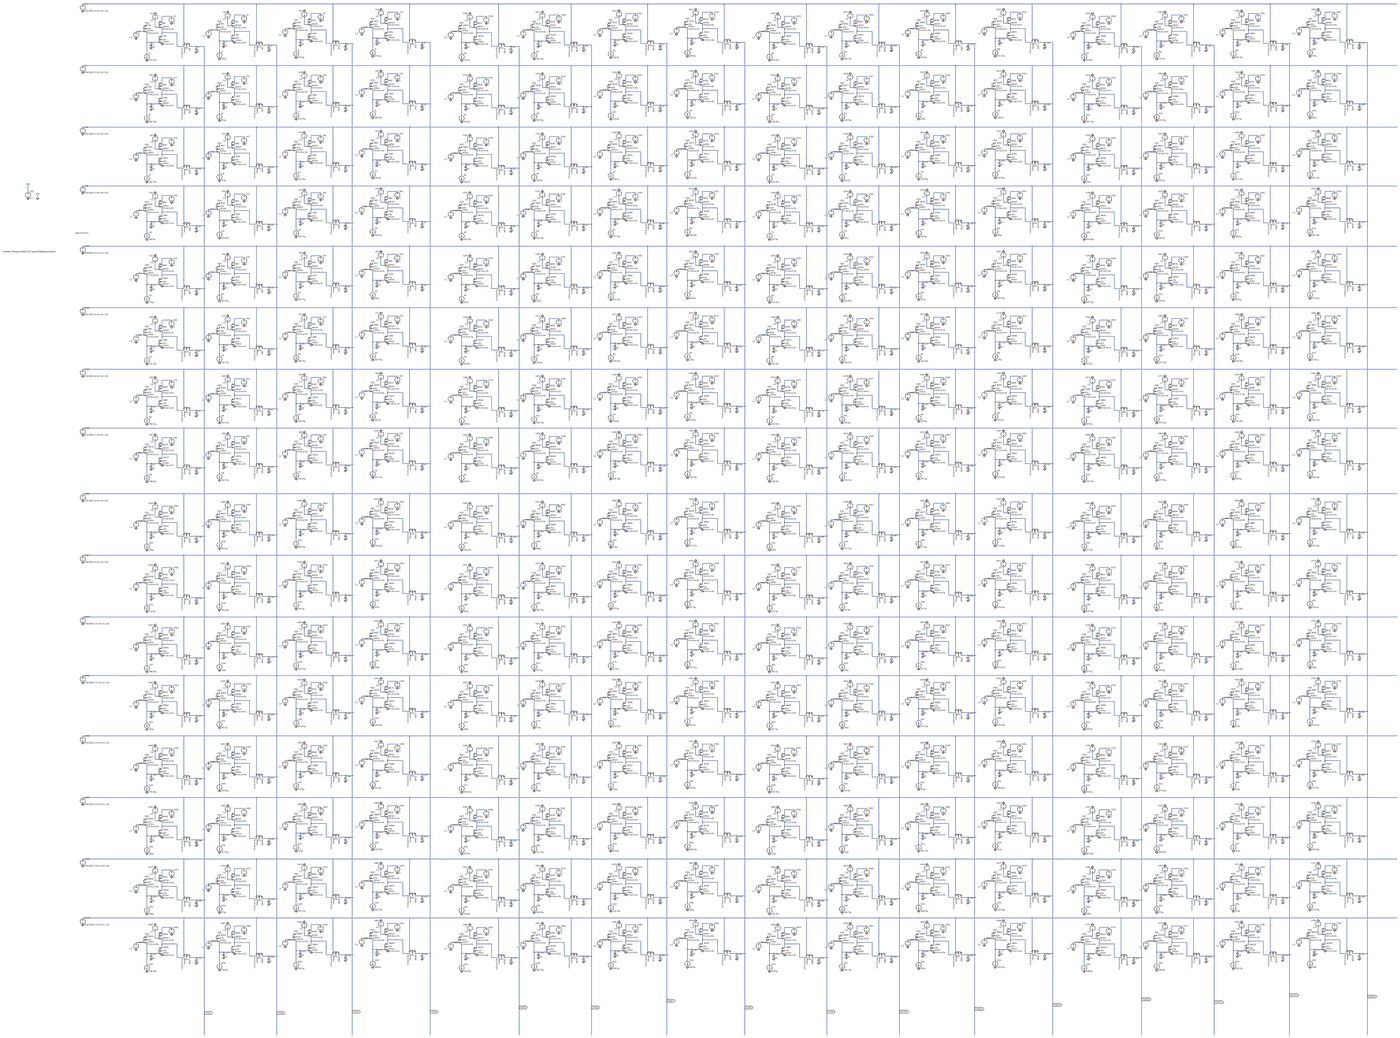
[diagram p0: schematic APS 16_16.asc, whole sheet]
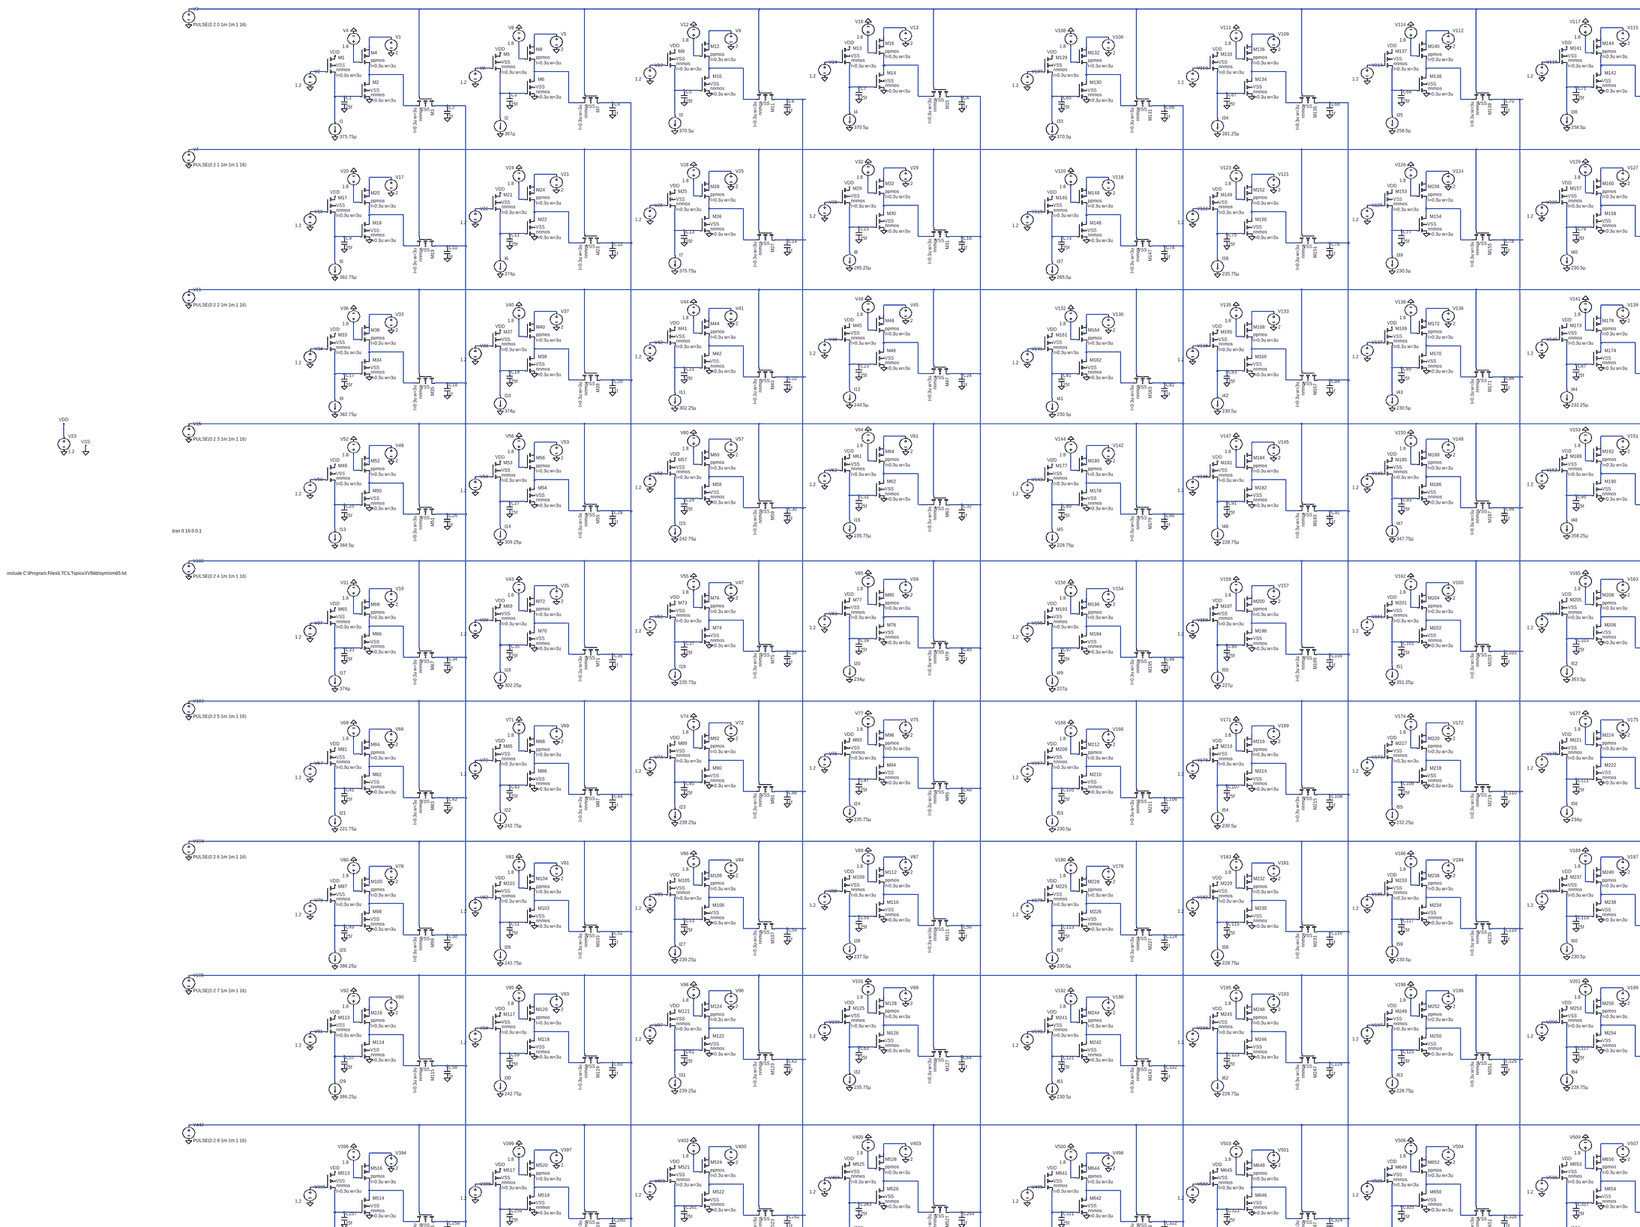
[diagram p1: schematic APS 16_16.asc, part, row 1 of 2, column 1 of 2]
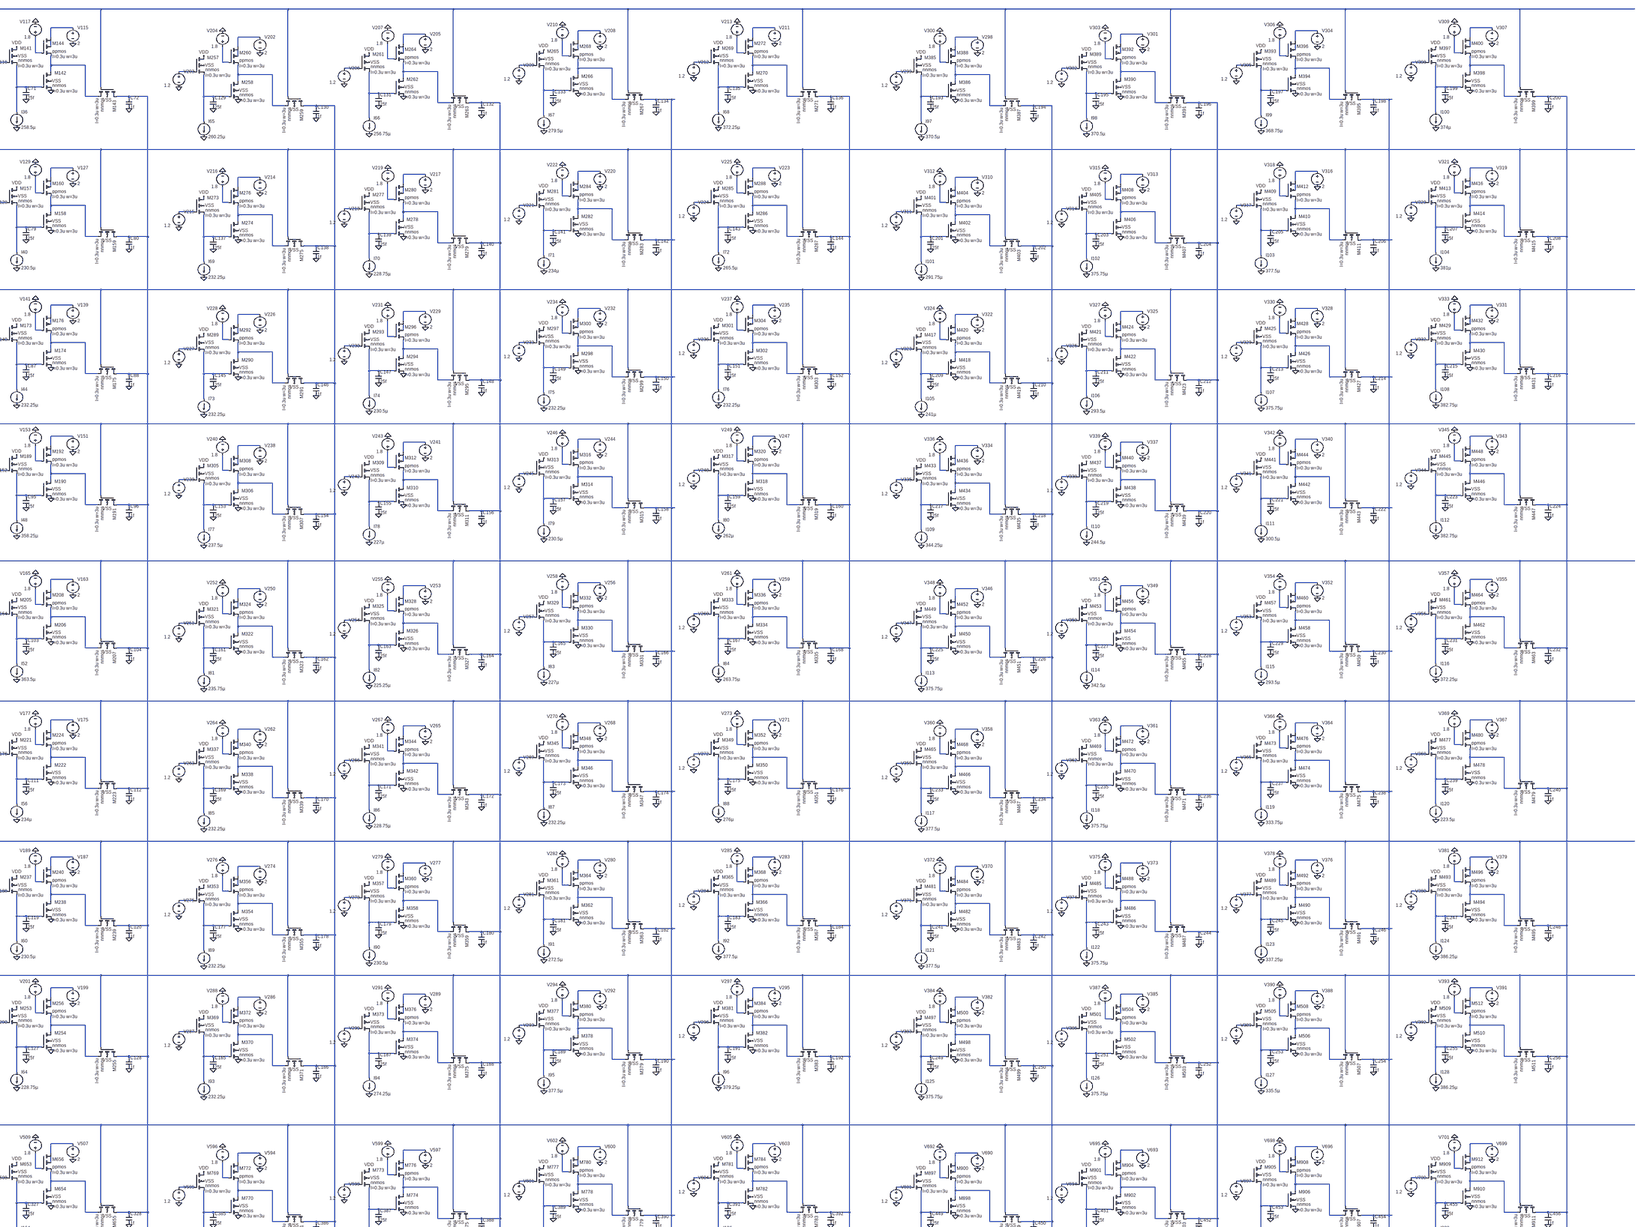
[diagram p2: schematic APS 16_16.asc, part, row 1 of 2, column 2 of 2]
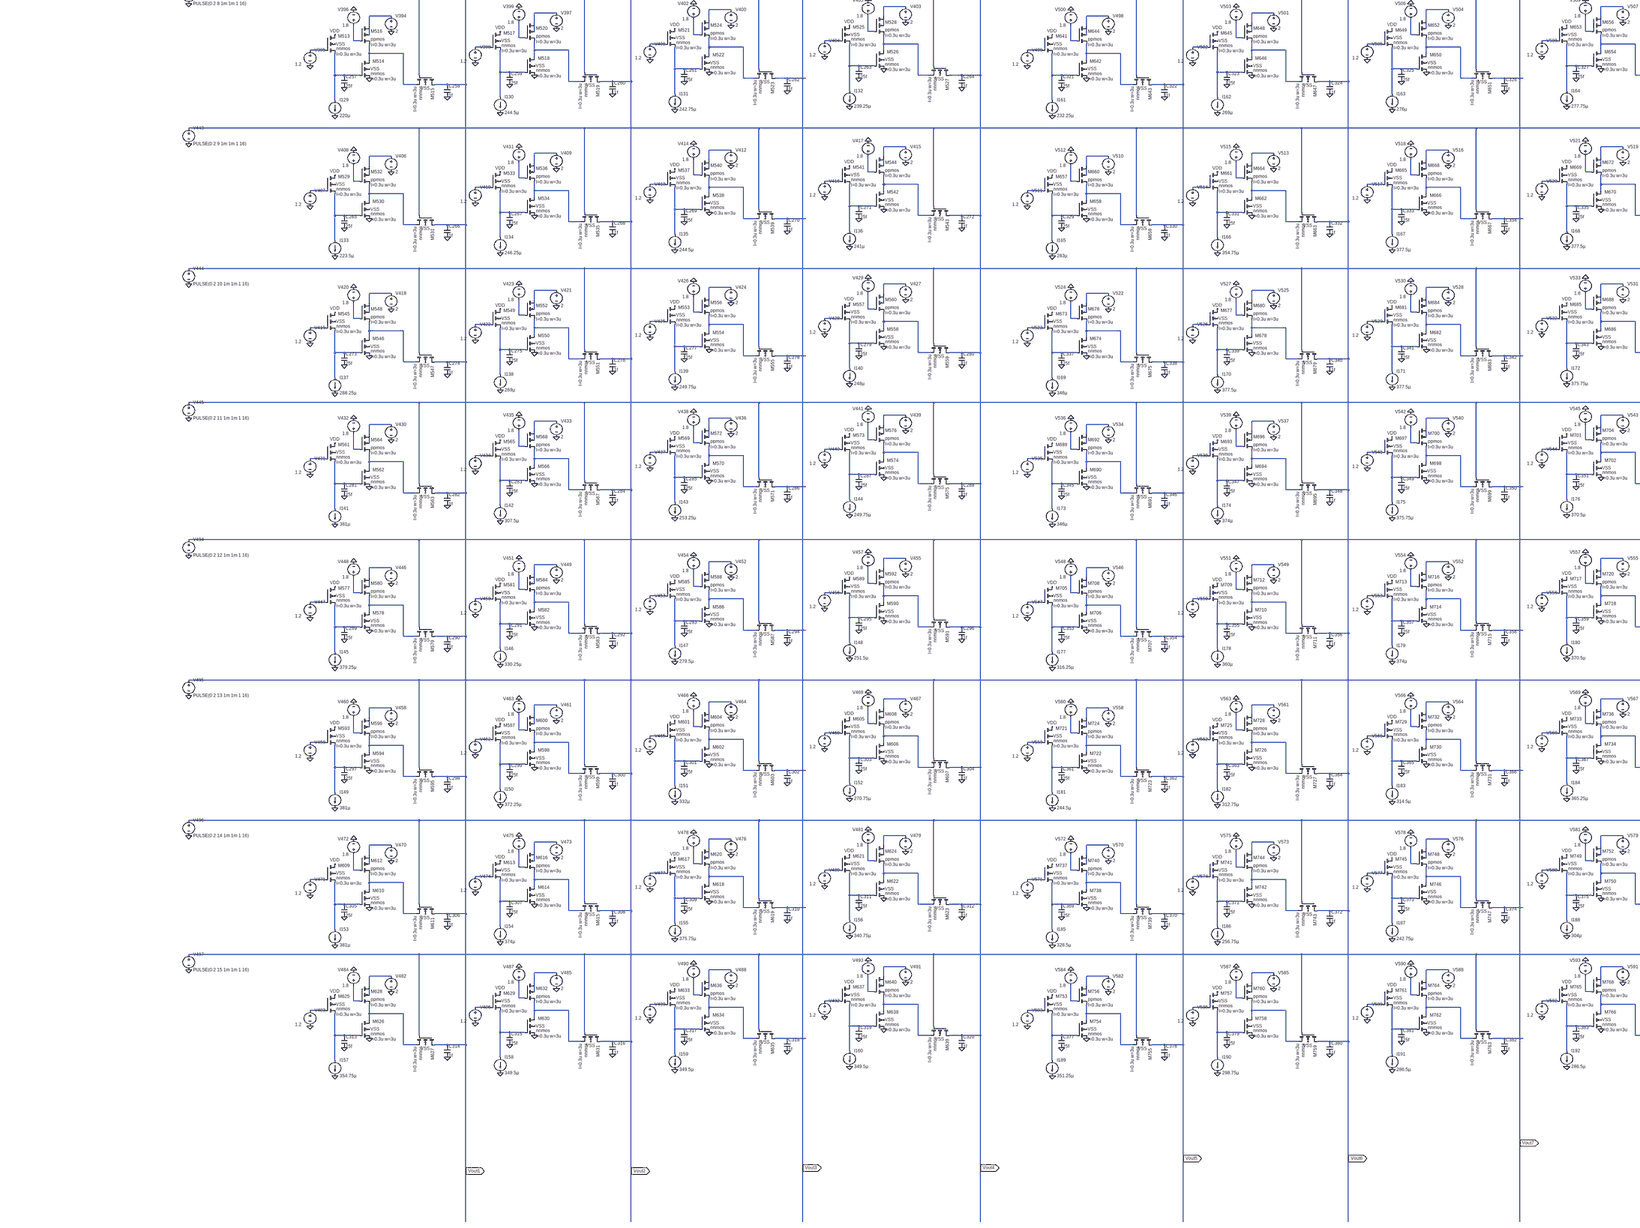
[diagram p3: schematic APS 16_16.asc, part, row 2 of 2, column 1 of 2]
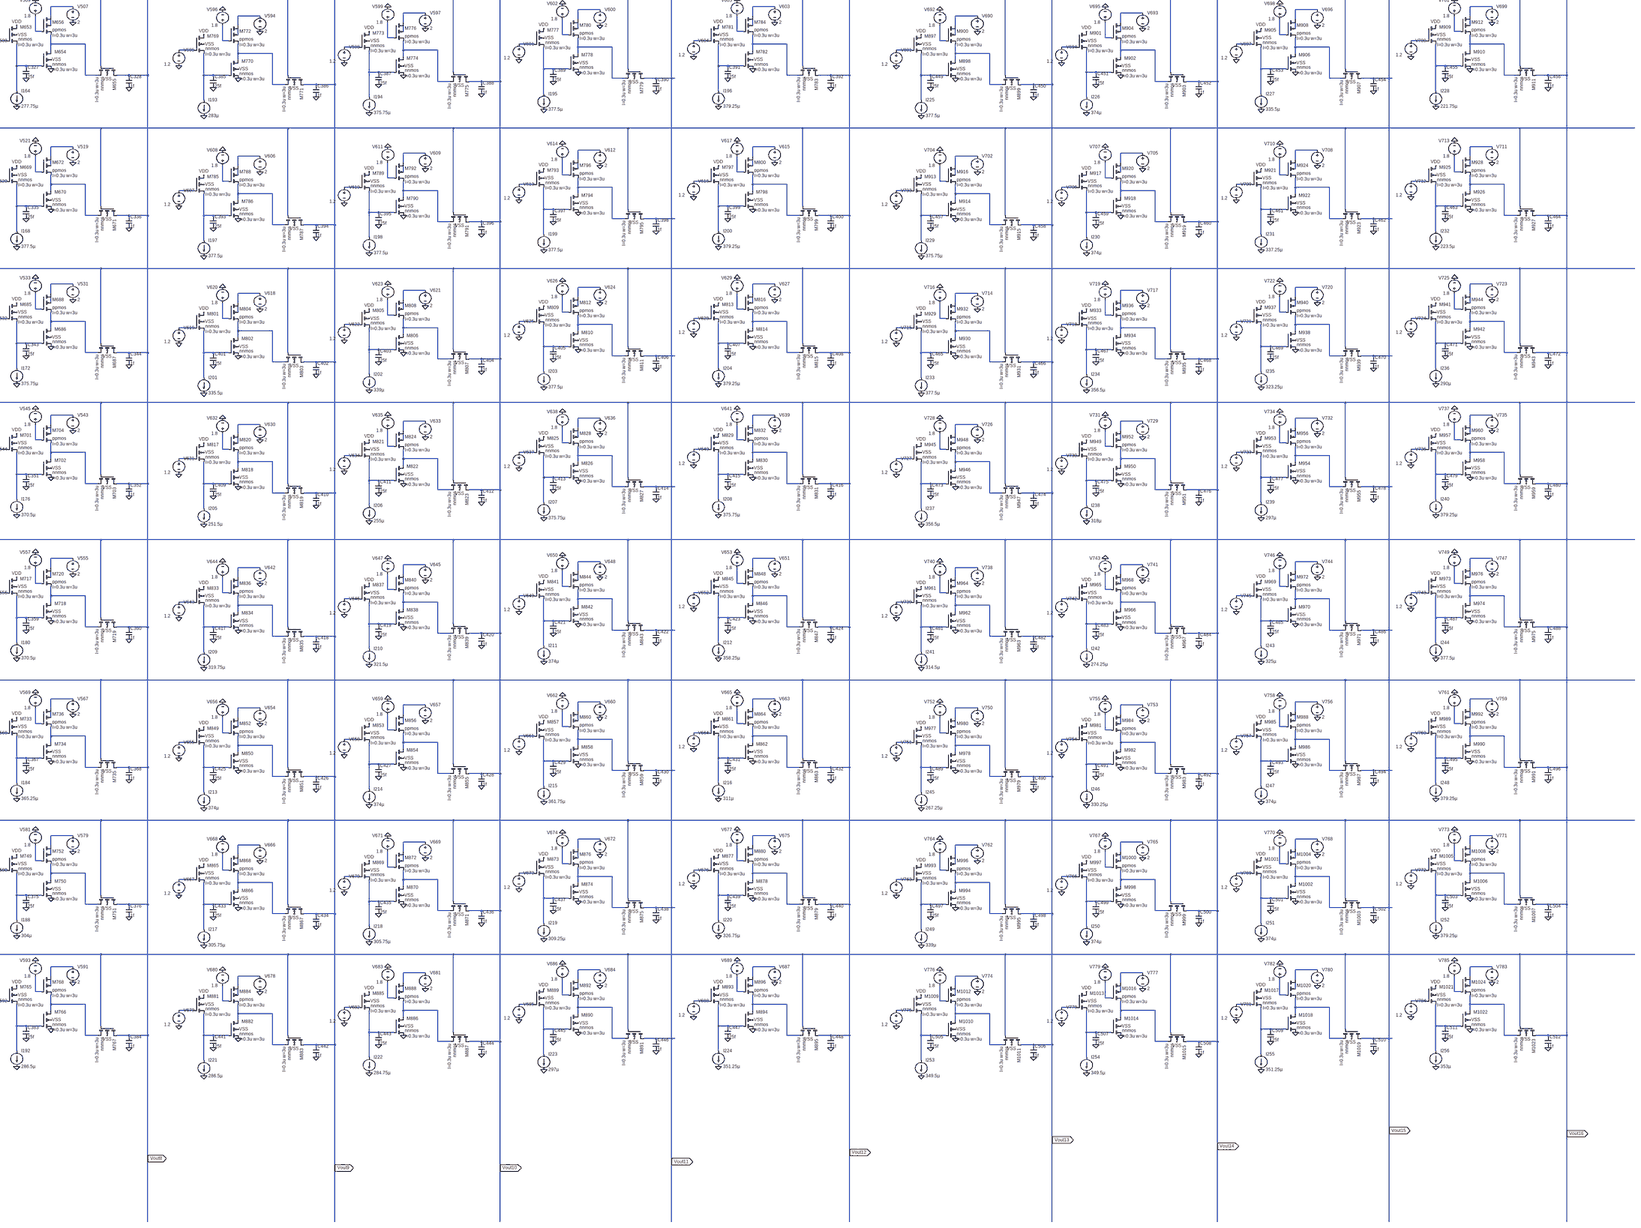
[diagram p4: schematic APS 16_16.asc, part, row 2 of 2, column 2 of 2]
* APS 16_16.asc
M1 VDD N070 N094 0 nnmos l=0.3u w=3u
M2 N078 N094 0 0 nnmos l=0.3u w=3u
M3 Vout1 N001 N078 0 nnmos l=0.3u w=3u
M4 N014 N046 N078 N034 ppmos l=0.3u w=3u
C1 N094 0 25f
C2 Vout1 0 1f
V1 N014 0 2
V2 N070 0 1.2
V4 N046 0 1.8
I1 N094 0 375.75µ
M5 VDD N062 N090 0 nnmos l=0.3u w=3u
M6 N071 N090 0 0 nnmos l=0.3u w=3u
M7 Vout2 N001 N071 0 nnmos l=0.3u w=3u
M8 N010 N042 N071 N026 ppmos l=0.3u w=3u
C3 N090 0 25f
C4 Vout2 0 1f
V5 N010 0 2
V6 N062 0 1.2
V8 N042 0 1.8
I2 N090 0 367µ
M9 VDD N054 N086 0 nnmos l=0.3u w=3u
M10 N063 N086 0 0 nnmos l=0.3u w=3u
M11 Vout3 N001 N063 0 nnmos l=0.3u w=3u
M12 N006 N035 N063 N022 ppmos l=0.3u w=3u
C5 N086 0 25f
C6 Vout3 0 1f
V9 N006 0 2
V10 N054 0 1.2
V12 N035 0 1.8
I3 N086 0 370.5µ
M13 VDD N047 N082 0 nnmos l=0.3u w=3u
M14 N055 N082 0 0 nnmos l=0.3u w=3u
M15 Vout4 N001 N055 0 nnmos l=0.3u w=3u
M16 N002 N027 N055 N018 ppmos l=0.3u w=3u
C7 N082 0 25f
C8 Vout4 0 1f
V13 N002 0 2
V14 N047 0 1.2
V16 N027 0 1.8
I4 N082 0 370.5µ
M17 VDD N167 N191 0 nnmos l=0.3u w=3u
M18 N175 N191 0 0 nnmos l=0.3u w=3u
M19 Vout1 N098 N175 0 nnmos l=0.3u w=3u
M20 N111 N143 N175 N131 ppmos l=0.3u w=3u
C9 N191 0 25f
C10 Vout1 0 1f
V17 N111 0 2
V18 N167 0 1.2
V20 N143 0 1.8
I5 N191 0 382.75µ
M21 VDD N159 N187 0 nnmos l=0.3u w=3u
M22 N168 N187 0 0 nnmos l=0.3u w=3u
M23 Vout2 N098 N168 0 nnmos l=0.3u w=3u
M24 N107 N139 N168 N123 ppmos l=0.3u w=3u
C11 N187 0 25f
C12 Vout2 0 1f
V21 N107 0 2
V22 N159 0 1.2
V24 N139 0 1.8
I6 N187 0 374µ
M25 VDD N151 N183 0 nnmos l=0.3u w=3u
M26 N160 N183 0 0 nnmos l=0.3u w=3u
M27 Vout3 N098 N160 0 nnmos l=0.3u w=3u
M28 N103 N132 N160 N119 ppmos l=0.3u w=3u
C13 N183 0 25f
C14 Vout3 0 1f
V25 N103 0 2
V26 N151 0 1.2
V28 N132 0 1.8
I7 N183 0 375.75µ
M29 VDD N144 N179 0 nnmos l=0.3u w=3u
M30 N152 N179 0 0 nnmos l=0.3u w=3u
M31 Vout4 N098 N152 0 nnmos l=0.3u w=3u
M32 N099 N124 N152 N115 ppmos l=0.3u w=3u
C15 N179 0 25f
C16 Vout4 0 1f
V29 N099 0 2
V30 N144 0 1.2
V32 N124 0 1.8
I8 N179 0 295.25µ
M33 VDD N264 N288 0 nnmos l=0.3u w=3u
M34 N272 N288 0 0 nnmos l=0.3u w=3u
M35 Vout1 N195 N272 0 nnmos l=0.3u w=3u
M36 N208 N240 N272 N228 ppmos l=0.3u w=3u
C17 N288 0 25f
C18 Vout1 0 1f
V33 N208 0 2
V34 N264 0 1.2
V36 N240 0 1.8
I9 N288 0 382.75µ
M37 VDD N256 N284 0 nnmos l=0.3u w=3u
M38 N265 N284 0 0 nnmos l=0.3u w=3u
M39 Vout2 N195 N265 0 nnmos l=0.3u w=3u
M40 N204 N236 N265 N220 ppmos l=0.3u w=3u
C19 N284 0 25f
C20 Vout2 0 1f
V37 N204 0 2
V38 N256 0 1.2
V40 N236 0 1.8
I10 N284 0 374µ
M41 VDD N248 N280 0 nnmos l=0.3u w=3u
M42 N257 N280 0 0 nnmos l=0.3u w=3u
M43 Vout3 N195 N257 0 nnmos l=0.3u w=3u
M44 N200 N229 N257 N216 ppmos l=0.3u w=3u
C21 N280 0 25f
C22 Vout3 0 1f
V41 N200 0 2
V42 N248 0 1.2
V44 N229 0 1.8
I11 N280 0 302.25µ
M45 VDD N241 N276 0 nnmos l=0.3u w=3u
M46 N249 N276 0 0 nnmos l=0.3u w=3u
M47 Vout4 N195 N249 0 nnmos l=0.3u w=3u
M48 N196 N221 N249 N212 ppmos l=0.3u w=3u
C23 N276 0 25f
C24 Vout4 0 1f
V45 N196 0 2
V46 N241 0 1.2
V48 N221 0 1.8
I12 N276 0 244.5µ
M49 VDD N361 N385 0 nnmos l=0.3u w=3u
M50 N369 N385 0 0 nnmos l=0.3u w=3u
M51 Vout1 N292 N369 0 nnmos l=0.3u w=3u
M52 N305 N337 N369 N325 ppmos l=0.3u w=3u
C25 N385 0 25f
C26 Vout1 0 1f
V49 N305 0 2
V50 N361 0 1.2
V52 N337 0 1.8
I13 N385 0 384.5µ
M53 VDD N353 N381 0 nnmos l=0.3u w=3u
M54 N362 N381 0 0 nnmos l=0.3u w=3u
M55 Vout2 N292 N362 0 nnmos l=0.3u w=3u
M56 N301 N333 N362 N317 ppmos l=0.3u w=3u
C27 N381 0 25f
C28 Vout2 0 1f
V53 N301 0 2
V54 N353 0 1.2
V56 N333 0 1.8
I14 N381 0 309.25µ
M57 VDD N345 N377 0 nnmos l=0.3u w=3u
M58 N354 N377 0 0 nnmos l=0.3u w=3u
M59 Vout3 N292 N354 0 nnmos l=0.3u w=3u
M60 N297 N326 N354 N313 ppmos l=0.3u w=3u
C29 N377 0 25f
C30 Vout3 0 1f
V57 N297 0 2
V58 N345 0 1.2
V60 N326 0 1.8
I15 N377 0 242.75µ
M61 VDD N338 N373 0 nnmos l=0.3u w=3u
M62 N346 N373 0 0 nnmos l=0.3u w=3u
M63 Vout4 N292 N346 0 nnmos l=0.3u w=3u
M64 N293 N318 N346 N309 ppmos l=0.3u w=3u
C31 N373 0 25f
C32 Vout4 0 1f
V61 N293 0 2
V62 N338 0 1.2
V64 N318 0 1.8
I16 N373 0 235.75µ
V3 N001 0 PULSE(0 2 0 1m 1m 1 16)
V7 N098 0 PULSE(0 2 1 1m 1m 1 16)
V11 N195 0 PULSE(0 2 2 1m 1m 1 16)
V15 N292 0 PULSE(0 2 3 1m 1m 1 16)
V23 VDD 0 1.2
M65 VDD N458 N482 0 nnmos l=0.3u w=3u
M66 N466 N482 0 0 nnmos l=0.3u w=3u
M67 Vout1 N389 N466 0 nnmos l=0.3u w=3u
M68 N402 N434 N466 N422 ppmos l=0.3u w=3u
C33 N482 0 25f
C34 Vout1 0 1f
V19 N402 0 2
V27 N458 0 1.2
V31 N434 0 1.8
I17 N482 0 374µ
M69 VDD N450 N478 0 nnmos l=0.3u w=3u
M70 N459 N478 0 0 nnmos l=0.3u w=3u
M71 Vout2 N389 N459 0 nnmos l=0.3u w=3u
M72 N398 N430 N459 N414 ppmos l=0.3u w=3u
C35 N478 0 25f
C36 Vout2 0 1f
V35 N398 0 2
V39 N450 0 1.2
V43 N430 0 1.8
I18 N478 0 302.25µ
M73 VDD N442 N474 0 nnmos l=0.3u w=3u
M74 N451 N474 0 0 nnmos l=0.3u w=3u
M75 Vout3 N389 N451 0 nnmos l=0.3u w=3u
M76 N394 N423 N451 N410 ppmos l=0.3u w=3u
C37 N474 0 25f
C38 Vout3 0 1f
V47 N394 0 2
V51 N442 0 1.2
V55 N423 0 1.8
I19 N474 0 235.75µ
M77 VDD N435 N470 0 nnmos l=0.3u w=3u
M78 N443 N470 0 0 nnmos l=0.3u w=3u
M79 Vout4 N389 N443 0 nnmos l=0.3u w=3u
M80 N390 N415 N443 N406 ppmos l=0.3u w=3u
C39 N470 0 25f
C40 Vout4 0 1f
V59 N390 0 2
V63 N435 0 1.2
V65 N415 0 1.8
I20 N470 0 234µ
M81 VDD N555 N579 0 nnmos l=0.3u w=3u
M82 N563 N579 0 0 nnmos l=0.3u w=3u
M83 Vout1 N486 N563 0 nnmos l=0.3u w=3u
M84 N499 N531 N563 N519 ppmos l=0.3u w=3u
C41 N579 0 25f
C42 Vout1 0 1f
V66 N499 0 2
V67 N555 0 1.2
V68 N531 0 1.8
I21 N579 0 221.75µ
M85 VDD N547 N575 0 nnmos l=0.3u w=3u
M86 N556 N575 0 0 nnmos l=0.3u w=3u
M87 Vout2 N486 N556 0 nnmos l=0.3u w=3u
M88 N495 N527 N556 N511 ppmos l=0.3u w=3u
C43 N575 0 25f
C44 Vout2 0 1f
V69 N495 0 2
V70 N547 0 1.2
V71 N527 0 1.8
I22 N575 0 242.75µ
M89 VDD N539 N571 0 nnmos l=0.3u w=3u
M90 N548 N571 0 0 nnmos l=0.3u w=3u
M91 Vout3 N486 N548 0 nnmos l=0.3u w=3u
M92 N491 N520 N548 N507 ppmos l=0.3u w=3u
C45 N571 0 25f
C46 Vout3 0 1f
V72 N491 0 2
V73 N539 0 1.2
V74 N520 0 1.8
I23 N571 0 239.25µ
M93 VDD N532 N567 0 nnmos l=0.3u w=3u
M94 N540 N567 0 0 nnmos l=0.3u w=3u
M95 Vout4 N486 N540 0 nnmos l=0.3u w=3u
M96 N487 N512 N540 N503 ppmos l=0.3u w=3u
C47 N567 0 25f
C48 Vout4 0 1f
V75 N487 0 2
V76 N532 0 1.2
V77 N512 0 1.8
I24 N567 0 235.75µ
M97 VDD N652 N676 0 nnmos l=0.3u w=3u
M98 N660 N676 0 0 nnmos l=0.3u w=3u
M99 Vout1 N583 N660 0 nnmos l=0.3u w=3u
M100 N596 N628 N660 N616 ppmos l=0.3u w=3u
C49 N676 0 25f
C50 Vout1 0 1f
V78 N596 0 2
V79 N652 0 1.2
V80 N628 0 1.8
I25 N676 0 386.25µ
M101 VDD N644 N672 0 nnmos l=0.3u w=3u
M102 N653 N672 0 0 nnmos l=0.3u w=3u
M103 Vout2 N583 N653 0 nnmos l=0.3u w=3u
M104 N592 N624 N653 N608 ppmos l=0.3u w=3u
C51 N672 0 25f
C52 Vout2 0 1f
V81 N592 0 2
V82 N644 0 1.2
V83 N624 0 1.8
I26 N672 0 242.75µ
M105 VDD N636 N668 0 nnmos l=0.3u w=3u
M106 N645 N668 0 0 nnmos l=0.3u w=3u
M107 Vout3 N583 N645 0 nnmos l=0.3u w=3u
M108 N588 N617 N645 N604 ppmos l=0.3u w=3u
C53 N668 0 25f
C54 Vout3 0 1f
V84 N588 0 2
V85 N636 0 1.2
V86 N617 0 1.8
I27 N668 0 239.25µ
M109 VDD N629 N664 0 nnmos l=0.3u w=3u
M110 N637 N664 0 0 nnmos l=0.3u w=3u
M111 Vout4 N583 N637 0 nnmos l=0.3u w=3u
M112 N584 N609 N637 N600 ppmos l=0.3u w=3u
C55 N664 0 25f
C56 Vout4 0 1f
V87 N584 0 2
V88 N629 0 1.2
V89 N609 0 1.8
I28 N664 0 237.5µ
M113 VDD N749 N773 0 nnmos l=0.3u w=3u
M114 N757 N773 0 0 nnmos l=0.3u w=3u
M115 Vout1 N680 N757 0 nnmos l=0.3u w=3u
M116 N693 N725 N757 N713 ppmos l=0.3u w=3u
C57 N773 0 25f
C58 Vout1 0 1f
V90 N693 0 2
V91 N749 0 1.2
V92 N725 0 1.8
I29 N773 0 386.25µ
M117 VDD N741 N769 0 nnmos l=0.3u w=3u
M118 N750 N769 0 0 nnmos l=0.3u w=3u
M119 Vout2 N680 N750 0 nnmos l=0.3u w=3u
M120 N689 N721 N750 N705 ppmos l=0.3u w=3u
C59 N769 0 25f
C60 Vout2 0 1f
V93 N689 0 2
V94 N741 0 1.2
V95 N721 0 1.8
I30 N769 0 242.75µ
M121 VDD N733 N765 0 nnmos l=0.3u w=3u
M122 N742 N765 0 0 nnmos l=0.3u w=3u
M123 Vout3 N680 N742 0 nnmos l=0.3u w=3u
M124 N685 N714 N742 N701 ppmos l=0.3u w=3u
C61 N765 0 25f
C62 Vout3 0 1f
V96 N685 0 2
V97 N733 0 1.2
V98 N714 0 1.8
I31 N765 0 239.25µ
M125 VDD N726 N761 0 nnmos l=0.3u w=3u
M126 N734 N761 0 0 nnmos l=0.3u w=3u
M127 Vout4 N680 N734 0 nnmos l=0.3u w=3u
M128 N681 N706 N734 N697 ppmos l=0.3u w=3u
C63 N761 0 25f
C64 Vout4 0 1f
V99 N681 0 2
V100 N726 0 1.2
V101 N706 0 1.8
I32 N761 0 235.75µ
V102 N389 0 PULSE(0 2 4 1m 1m 1 16)
V103 N486 0 PULSE(0 2 5 1m 1m 1 16)
V104 N583 0 PULSE(0 2 6 1m 1m 1 16)
V105 N680 0 PULSE(0 2 7 1m 1m 1 16)
M129 VDD N072 N095 0 nnmos l=0.3u w=3u
M130 N079 N095 0 0 nnmos l=0.3u w=3u
M131 Vout5 N001 N079 0 nnmos l=0.3u w=3u
M132 N015 N048 N079 N036 ppmos l=0.3u w=3u
C65 N095 0 25f
C66 Vout5 0 1f
V106 N015 0 2
V107 N072 0 1.2
V108 N048 0 1.8
I33 N095 0 370.5µ
M133 VDD N064 N091 0 nnmos l=0.3u w=3u
M134 N073 N091 0 0 nnmos l=0.3u w=3u
M135 Vout6 N001 N073 0 nnmos l=0.3u w=3u
M136 N011 N043 N073 N028 ppmos l=0.3u w=3u
C67 N091 0 25f
C68 Vout6 0 1f
V109 N011 0 2
V110 N064 0 1.2
V111 N043 0 1.8
I34 N091 0 281.25µ
M137 VDD N056 N087 0 nnmos l=0.3u w=3u
M138 N065 N087 0 0 nnmos l=0.3u w=3u
M139 Vout7 N001 N065 0 nnmos l=0.3u w=3u
M140 N007 N037 N065 N023 ppmos l=0.3u w=3u
C69 N087 0 25f
C70 Vout7 0 1f
V112 N007 0 2
V113 N056 0 1.2
V114 N037 0 1.8
I35 N087 0 258.5µ
M141 VDD N049 N083 0 nnmos l=0.3u w=3u
M142 N057 N083 0 0 nnmos l=0.3u w=3u
M143 Vout8 N001 N057 0 nnmos l=0.3u w=3u
M144 N003 N029 N057 N019 ppmos l=0.3u w=3u
C71 N083 0 25f
C72 Vout8 0 1f
V115 N003 0 2
V116 N049 0 1.2
V117 N029 0 1.8
I36 N083 0 258.5µ
M145 VDD N169 N192 0 nnmos l=0.3u w=3u
M146 N176 N192 0 0 nnmos l=0.3u w=3u
M147 Vout5 N098 N176 0 nnmos l=0.3u w=3u
M148 N112 N145 N176 N133 ppmos l=0.3u w=3u
C73 N192 0 25f
C74 Vout5 0 1f
V118 N112 0 2
V119 N169 0 1.2
V120 N145 0 1.8
I37 N192 0 265.5µ
M149 VDD N161 N188 0 nnmos l=0.3u w=3u
M150 N170 N188 0 0 nnmos l=0.3u w=3u
M151 Vout6 N098 N170 0 nnmos l=0.3u w=3u
M152 N108 N140 N170 N125 ppmos l=0.3u w=3u
C75 N188 0 25f
C76 Vout6 0 1f
V121 N108 0 2
V122 N161 0 1.2
V123 N140 0 1.8
I38 N188 0 235.75µ
M153 VDD N153 N184 0 nnmos l=0.3u w=3u
M154 N162 N184 0 0 nnmos l=0.3u w=3u
M155 Vout7 N098 N162 0 nnmos l=0.3u w=3u
M156 N104 N134 N162 N120 ppmos l=0.3u w=3u
C77 N184 0 25f
C78 Vout7 0 1f
V124 N104 0 2
V125 N153 0 1.2
V126 N134 0 1.8
I39 N184 0 230.5µ
M157 VDD N146 N180 0 nnmos l=0.3u w=3u
M158 N154 N180 0 0 nnmos l=0.3u w=3u
M159 Vout8 N098 N154 0 nnmos l=0.3u w=3u
M160 N100 N126 N154 N116 ppmos l=0.3u w=3u
C79 N180 0 25f
C80 Vout8 0 1f
V127 N100 0 2
V128 N146 0 1.2
V129 N126 0 1.8
I40 N180 0 230.5µ
M161 VDD N266 N289 0 nnmos l=0.3u w=3u
M162 N273 N289 0 0 nnmos l=0.3u w=3u
M163 Vout5 N195 N273 0 nnmos l=0.3u w=3u
M164 N209 N242 N273 N230 ppmos l=0.3u w=3u
C81 N289 0 25f
C82 Vout5 0 1f
V130 N209 0 2
V131 N266 0 1.2
V132 N242 0 1.8
I41 N289 0 230.5µ
M165 VDD N258 N285 0 nnmos l=0.3u w=3u
M166 N267 N285 0 0 nnmos l=0.3u w=3u
M167 Vout6 N195 N267 0 nnmos l=0.3u w=3u
M168 N205 N237 N267 N222 ppmos l=0.3u w=3u
C83 N285 0 25f
C84 Vout6 0 1f
V133 N205 0 2
V134 N258 0 1.2
V135 N237 0 1.8
I42 N285 0 230.5µ
M169 VDD N250 N281 0 nnmos l=0.3u w=3u
M170 N259 N281 0 0 nnmos l=0.3u w=3u
M171 Vout7 N195 N259 0 nnmos l=0.3u w=3u
M172 N201 N231 N259 N217 ppmos l=0.3u w=3u
C85 N281 0 25f
C86 Vout7 0 1f
V136 N201 0 2
V137 N250 0 1.2
V138 N231 0 1.8
I43 N281 0 230.5µ
M173 VDD N243 N277 0 nnmos l=0.3u w=3u
M174 N251 N277 0 0 nnmos l=0.3u w=3u
M175 Vout8 N195 N251 0 nnmos l=0.3u w=3u
M176 N197 N223 N251 N213 ppmos l=0.3u w=3u
C87 N277 0 25f
C88 Vout8 0 1f
V139 N197 0 2
V140 N243 0 1.2
V141 N223 0 1.8
I44 N277 0 232.25µ
M177 VDD N363 N386 0 nnmos l=0.3u w=3u
M178 N370 N386 0 0 nnmos l=0.3u w=3u
M179 Vout5 N292 N370 0 nnmos l=0.3u w=3u
M180 N306 N339 N370 N327 ppmos l=0.3u w=3u
C89 N386 0 25f
C90 Vout5 0 1f
V142 N306 0 2
V143 N363 0 1.2
V144 N339 0 1.8
I45 N386 0 228.75µ
M181 VDD N355 N382 0 nnmos l=0.3u w=3u
M182 N364 N382 0 0 nnmos l=0.3u w=3u
M183 Vout6 N292 N364 0 nnmos l=0.3u w=3u
M184 N302 N334 N364 N319 ppmos l=0.3u w=3u
C91 N382 0 25f
C92 Vout6 0 1f
V145 N302 0 2
V146 N355 0 1.2
V147 N334 0 1.8
I46 N382 0 228.75µ
M185 VDD N347 N378 0 nnmos l=0.3u w=3u
M186 N356 N378 0 0 nnmos l=0.3u w=3u
M187 Vout7 N292 N356 0 nnmos l=0.3u w=3u
M188 N298 N328 N356 N314 ppmos l=0.3u w=3u
C93 N378 0 25f
C94 Vout7 0 1f
V148 N298 0 2
V149 N347 0 1.2
V150 N328 0 1.8
I47 N378 0 347.75µ
M189 VDD N340 N374 0 nnmos l=0.3u w=3u
M190 N348 N374 0 0 nnmos l=0.3u w=3u
M191 Vout8 N292 N348 0 nnmos l=0.3u w=3u
M192 N294 N320 N348 N310 ppmos l=0.3u w=3u
C95 N374 0 25f
C96 Vout8 0 1f
V151 N294 0 2
V152 N340 0 1.2
V153 N320 0 1.8
I48 N374 0 358.25µ
M193 VDD N460 N483 0 nnmos l=0.3u w=3u
M194 N467 N483 0 0 nnmos l=0.3u w=3u
M195 Vout5 N389 N467 0 nnmos l=0.3u w=3u
M196 N403 N436 N467 N424 ppmos l=0.3u w=3u
C97 N483 0 25f
C98 Vout5 0 1f
V154 N403 0 2
V155 N460 0 1.2
V156 N436 0 1.8
I49 N483 0 227µ
M197 VDD N452 N479 0 nnmos l=0.3u w=3u
M198 N461 N479 0 0 nnmos l=0.3u w=3u
M199 Vout6 N389 N461 0 nnmos l=0.3u w=3u
M200 N399 N431 N461 N416 ppmos l=0.3u w=3u
C99 N479 0 25f
C100 Vout6 0 1f
V157 N399 0 2
V158 N452 0 1.2
V159 N431 0 1.8
I50 N479 0 227µ
M201 VDD N444 N475 0 nnmos l=0.3u w=3u
M202 N453 N475 0 0 nnmos l=0.3u w=3u
M203 Vout7 N389 N453 0 nnmos l=0.3u w=3u
M204 N395 N425 N453 N411 ppmos l=0.3u w=3u
C101 N475 0 25f
C102 Vout7 0 1f
V160 N395 0 2
V161 N444 0 1.2
V162 N425 0 1.8
I51 N475 0 351.25µ
M205 VDD N437 N471 0 nnmos l=0.3u w=3u
M206 N445 N471 0 0 nnmos l=0.3u w=3u
M207 Vout8 N389 N445 0 nnmos l=0.3u w=3u
M208 N391 N417 N445 N407 ppmos l=0.3u w=3u
C103 N471 0 25f
C104 Vout8 0 1f
V163 N391 0 2
V164 N437 0 1.2
V165 N417 0 1.8
I52 N471 0 363.5µ
M209 VDD N557 N580 0 nnmos l=0.3u w=3u
M210 N564 N580 0 0 nnmos l=0.3u w=3u
M211 Vout5 N486 N564 0 nnmos l=0.3u w=3u
M212 N500 N533 N564 N521 ppmos l=0.3u w=3u
C105 N580 0 25f
C106 Vout5 0 1f
V166 N500 0 2
V167 N557 0 1.2
V168 N533 0 1.8
I53 N580 0 230.5µ
M213 VDD N549 N576 0 nnmos l=0.3u w=3u
M214 N558 N576 0 0 nnmos l=0.3u w=3u
M215 Vout6 N486 N558 0 nnmos l=0.3u w=3u
M216 N496 N528 N558 N513 ppmos l=0.3u w=3u
C107 N576 0 25f
C108 Vout6 0 1f
V169 N496 0 2
V170 N549 0 1.2
V171 N528 0 1.8
I54 N576 0 230.5µ
M217 VDD N541 N572 0 nnmos l=0.3u w=3u
M218 N550 N572 0 0 nnmos l=0.3u w=3u
M219 Vout7 N486 N550 0 nnmos l=0.3u w=3u
M220 N492 N522 N550 N508 ppmos l=0.3u w=3u
C109 N572 0 25f
C110 Vout7 0 1f
V172 N492 0 2
V173 N541 0 1.2
V174 N522 0 1.8
I55 N572 0 232.25µ
M221 VDD N534 N568 0 nnmos l=0.3u w=3u
M222 N542 N568 0 0 nnmos l=0.3u w=3u
M223 Vout8 N486 N542 0 nnmos l=0.3u w=3u
M224 N488 N514 N542 N504 ppmos l=0.3u w=3u
C111 N568 0 25f
C112 Vout8 0 1f
V175 N488 0 2
V176 N534 0 1.2
V177 N514 0 1.8
I56 N568 0 234µ
M225 VDD N654 N677 0 nnmos l=0.3u w=3u
M226 N661 N677 0 0 nnmos l=0.3u w=3u
M227 Vout5 N583 N661 0 nnmos l=0.3u w=3u
M228 N597 N630 N661 N618 ppmos l=0.3u w=3u
C113 N677 0 25f
C114 Vout5 0 1f
V178 N597 0 2
V179 N654 0 1.2
V180 N630 0 1.8
I57 N677 0 230.5µ
M229 VDD N646 N673 0 nnmos l=0.3u w=3u
M230 N655 N673 0 0 nnmos l=0.3u w=3u
M231 Vout6 N583 N655 0 nnmos l=0.3u w=3u
M232 N593 N625 N655 N610 ppmos l=0.3u w=3u
C115 N673 0 25f
C116 Vout6 0 1f
V181 N593 0 2
V182 N646 0 1.2
V183 N625 0 1.8
I58 N673 0 228.75µ
M233 VDD N638 N669 0 nnmos l=0.3u w=3u
M234 N647 N669 0 0 nnmos l=0.3u w=3u
M235 Vout7 N583 N647 0 nnmos l=0.3u w=3u
M236 N589 N619 N647 N605 ppmos l=0.3u w=3u
C117 N669 0 25f
C118 Vout7 0 1f
V184 N589 0 2
V185 N638 0 1.2
V186 N619 0 1.8
I59 N669 0 230.5µ
M237 VDD N631 N665 0 nnmos l=0.3u w=3u
M238 N639 N665 0 0 nnmos l=0.3u w=3u
M239 Vout8 N583 N639 0 nnmos l=0.3u w=3u
M240 N585 N611 N639 N601 ppmos l=0.3u w=3u
C119 N665 0 25f
C120 Vout8 0 1f
V187 N585 0 2
V188 N631 0 1.2
V189 N611 0 1.8
I60 N665 0 230.5µ
M241 VDD N751 N774 0 nnmos l=0.3u w=3u
M242 N758 N774 0 0 nnmos l=0.3u w=3u
M243 Vout5 N680 N758 0 nnmos l=0.3u w=3u
M244 N694 N727 N758 N715 ppmos l=0.3u w=3u
C121 N774 0 25f
C122 Vout5 0 1f
V190 N694 0 2
V191 N751 0 1.2
V192 N727 0 1.8
I61 N774 0 230.5µ
M245 VDD N743 N770 0 nnmos l=0.3u w=3u
M246 N752 N770 0 0 nnmos l=0.3u w=3u
M247 Vout6 N680 N752 0 nnmos l=0.3u w=3u
M248 N690 N722 N752 N707 ppmos l=0.3u w=3u
C123 N770 0 25f
C124 Vout6 0 1f
V193 N690 0 2
V194 N743 0 1.2
V195 N722 0 1.8
I62 N770 0 228.75µ
M249 VDD N735 N766 0 nnmos l=0.3u w=3u
M250 N744 N766 0 0 nnmos l=0.3u w=3u
M251 Vout7 N680 N744 0 nnmos l=0.3u w=3u
M252 N686 N716 N744 N702 ppmos l=0.3u w=3u
C125 N766 0 25f
C126 Vout7 0 1f
V196 N686 0 2
V197 N735 0 1.2
V198 N716 0 1.8
I63 N766 0 228.75µ
M253 VDD N728 N762 0 nnmos l=0.3u w=3u
M254 N736 N762 0 0 nnmos l=0.3u w=3u
M255 Vout8 N680 N736 0 nnmos l=0.3u w=3u
M256 N682 N708 N736 N698 ppmos l=0.3u w=3u
C127 N762 0 25f
C128 Vout8 0 1f
V199 N682 0 2
V200 N728 0 1.2
V201 N708 0 1.8
I64 N762 0 228.75µ
M257 VDD N074 N096 0 nnmos l=0.3u w=3u
M258 N080 N096 0 0 nnmos l=0.3u w=3u
M259 Vout9 N001 N080 0 nnmos l=0.3u w=3u
M260 N016 N050 N080 N038 ppmos l=0.3u w=3u
C129 N096 0 25f
C130 Vout9 0 1f
V202 N016 0 2
V203 N074 0 1.2
V204 N050 0 1.8
I65 N096 0 260.25µ
M261 VDD N066 N092 0 nnmos l=0.3u w=3u
M262 N075 N092 0 0 nnmos l=0.3u w=3u
M263 Vout10 N001 N075 0 nnmos l=0.3u w=3u
M264 N012 N044 N075 N030 ppmos l=0.3u w=3u
C131 N092 0 25f
C132 Vout10 0 1f
V205 N012 0 2
V206 N066 0 1.2
V207 N044 0 1.8
I66 N092 0 256.75µ
M265 VDD N058 N088 0 nnmos l=0.3u w=3u
M266 N067 N088 0 0 nnmos l=0.3u w=3u
M267 Vout11 N001 N067 0 nnmos l=0.3u w=3u
M268 N008 N039 N067 N024 ppmos l=0.3u w=3u
C133 N088 0 25f
C134 Vout11 0 1f
V208 N008 0 2
V209 N058 0 1.2
V210 N039 0 1.8
I67 N088 0 279.5µ
M269 VDD N051 N084 0 nnmos l=0.3u w=3u
M270 N059 N084 0 0 nnmos l=0.3u w=3u
M271 Vout12 N001 N059 0 nnmos l=0.3u w=3u
M272 N004 N031 N059 N020 ppmos l=0.3u w=3u
C135 N084 0 25f
C136 Vout12 0 1f
V211 N004 0 2
V212 N051 0 1.2
V213 N031 0 1.8
I68 N084 0 372.25µ
M273 VDD N171 N193 0 nnmos l=0.3u w=3u
M274 N177 N193 0 0 nnmos l=0.3u w=3u
M275 Vout9 N098 N177 0 nnmos l=0.3u w=3u
M276 N113 N147 N177 N135 ppmos l=0.3u w=3u
C137 N193 0 25f
C138 Vout9 0 1f
V214 N113 0 2
V215 N171 0 1.2
V216 N147 0 1.8
I69 N193 0 232.25µ
M277 VDD N163 N189 0 nnmos l=0.3u w=3u
M278 N172 N189 0 0 nnmos l=0.3u w=3u
M279 Vout10 N098 N172 0 nnmos l=0.3u w=3u
M280 N109 N141 N172 N127 ppmos l=0.3u w=3u
C139 N189 0 25f
C140 Vout10 0 1f
V217 N109 0 2
V218 N163 0 1.2
V219 N141 0 1.8
I70 N189 0 228.75µ
M281 VDD N155 N185 0 nnmos l=0.3u w=3u
M282 N164 N185 0 0 nnmos l=0.3u w=3u
M283 Vout11 N098 N164 0 nnmos l=0.3u w=3u
M284 N105 N136 N164 N121 ppmos l=0.3u w=3u
C141 N185 0 25f
C142 Vout11 0 1f
V220 N105 0 2
V221 N155 0 1.2
V222 N136 0 1.8
I71 N185 0 234µ
M285 VDD N148 N181 0 nnmos l=0.3u w=3u
M286 N156 N181 0 0 nnmos l=0.3u w=3u
M287 Vout12 N098 N156 0 nnmos l=0.3u w=3u
M288 N101 N128 N156 N117 ppmos l=0.3u w=3u
C143 N181 0 25f
C144 Vout12 0 1f
V223 N101 0 2
V224 N148 0 1.2
V225 N128 0 1.8
I72 N181 0 265.5µ
M289 VDD N268 N290 0 nnmos l=0.3u w=3u
M290 N274 N290 0 0 nnmos l=0.3u w=3u
M291 Vout9 N195 N274 0 nnmos l=0.3u w=3u
M292 N210 N244 N274 N232 ppmos l=0.3u w=3u
C145 N290 0 25f
C146 Vout9 0 1f
V226 N210 0 2
V227 N268 0 1.2
V228 N244 0 1.8
I73 N290 0 232.25µ
M293 VDD N260 N286 0 nnmos l=0.3u w=3u
M294 N269 N286 0 0 nnmos l=0.3u w=3u
M295 Vout10 N195 N269 0 nnmos l=0.3u w=3u
M296 N206 N238 N269 N224 ppmos l=0.3u w=3u
C147 N286 0 25f
C148 Vout10 0 1f
V229 N206 0 2
V230 N260 0 1.2
V231 N238 0 1.8
I74 N286 0 230.5µ
M297 VDD N252 N282 0 nnmos l=0.3u w=3u
M298 N261 N282 0 0 nnmos l=0.3u w=3u
M299 Vout11 N195 N261 0 nnmos l=0.3u w=3u
M300 N202 N233 N261 N218 ppmos l=0.3u w=3u
C149 N282 0 25f
C150 Vout11 0 1f
V232 N202 0 2
V233 N252 0 1.2
V234 N233 0 1.8
I75 N282 0 232.25µ
M301 VDD N245 N278 0 nnmos l=0.3u w=3u
M302 N253 N278 0 0 nnmos l=0.3u w=3u
M303 Vout12 N195 N253 0 nnmos l=0.3u w=3u
M304 N198 N225 N253 N214 ppmos l=0.3u w=3u
C151 N278 0 25f
C152 Vout12 0 1f
V235 N198 0 2
V236 N245 0 1.2
V237 N225 0 1.8
I76 N278 0 232.25µ
M305 VDD N365 N387 0 nnmos l=0.3u w=3u
M306 N371 N387 0 0 nnmos l=0.3u w=3u
M307 Vout9 N292 N371 0 nnmos l=0.3u w=3u
M308 N307 N341 N371 N329 ppmos l=0.3u w=3u
C153 N387 0 25f
C154 Vout9 0 1f
V238 N307 0 2
V239 N365 0 1.2
V240 N341 0 1.8
I77 N387 0 237.5µ
M309 VDD N357 N383 0 nnmos l=0.3u w=3u
M310 N366 N383 0 0 nnmos l=0.3u w=3u
M311 Vout10 N292 N366 0 nnmos l=0.3u w=3u
M312 N303 N335 N366 N321 ppmos l=0.3u w=3u
C155 N383 0 25f
C156 Vout10 0 1f
V241 N303 0 2
V242 N357 0 1.2
V243 N335 0 1.8
I78 N383 0 227µ
M313 VDD N349 N379 0 nnmos l=0.3u w=3u
M314 N358 N379 0 0 nnmos l=0.3u w=3u
M315 Vout11 N292 N358 0 nnmos l=0.3u w=3u
M316 N299 N330 N358 N315 ppmos l=0.3u w=3u
C157 N379 0 25f
C158 Vout11 0 1f
V244 N299 0 2
V245 N349 0 1.2
V246 N330 0 1.8
I79 N379 0 230.5µ
M317 VDD N342 N375 0 nnmos l=0.3u w=3u
M318 N350 N375 0 0 nnmos l=0.3u w=3u
M319 Vout12 N292 N350 0 nnmos l=0.3u w=3u
M320 N295 N322 N350 N311 ppmos l=0.3u w=3u
C159 N375 0 25f
C160 Vout12 0 1f
V247 N295 0 2
V248 N342 0 1.2
V249 N322 0 1.8
I80 N375 0 262µ
M321 VDD N462 N484 0 nnmos l=0.3u w=3u
M322 N468 N484 0 0 nnmos l=0.3u w=3u
M323 Vout9 N389 N468 0 nnmos l=0.3u w=3u
M324 N404 N438 N468 N426 ppmos l=0.3u w=3u
C161 N484 0 25f
C162 Vout9 0 1f
V250 N404 0 2
V251 N462 0 1.2
V252 N438 0 1.8
I81 N484 0 235.75µ
M325 VDD N454 N480 0 nnmos l=0.3u w=3u
M326 N463 N480 0 0 nnmos l=0.3u w=3u
M327 Vout10 N389 N463 0 nnmos l=0.3u w=3u
M328 N400 N432 N463 N418 ppmos l=0.3u w=3u
C163 N480 0 25f
C164 Vout10 0 1f
V253 N400 0 2
V254 N454 0 1.2
V255 N432 0 1.8
I82 N480 0 225.25µ
M329 VDD N446 N476 0 nnmos l=0.3u w=3u
M330 N455 N476 0 0 nnmos l=0.3u w=3u
M331 Vout11 N389 N455 0 nnmos l=0.3u w=3u
M332 N396 N427 N455 N412 ppmos l=0.3u w=3u
C165 N476 0 25f
C166 Vout11 0 1f
V256 N396 0 2
V257 N446 0 1.2
V258 N427 0 1.8
I83 N476 0 227µ
M333 VDD N439 N472 0 nnmos l=0.3u w=3u
M334 N447 N472 0 0 nnmos l=0.3u w=3u
M335 Vout12 N389 N447 0 nnmos l=0.3u w=3u
M336 N392 N419 N447 N408 ppmos l=0.3u w=3u
C167 N472 0 25f
C168 Vout12 0 1f
V259 N392 0 2
V260 N439 0 1.2
V261 N419 0 1.8
I84 N472 0 263.75µ
M337 VDD N559 N581 0 nnmos l=0.3u w=3u
M338 N565 N581 0 0 nnmos l=0.3u w=3u
M339 Vout9 N486 N565 0 nnmos l=0.3u w=3u
M340 N501 N535 N565 N523 ppmos l=0.3u w=3u
C169 N581 0 25f
C170 Vout9 0 1f
V262 N501 0 2
V263 N559 0 1.2
V264 N535 0 1.8
I85 N581 0 232.25µ
M341 VDD N551 N577 0 nnmos l=0.3u w=3u
M342 N560 N577 0 0 nnmos l=0.3u w=3u
M343 Vout10 N486 N560 0 nnmos l=0.3u w=3u
M344 N497 N529 N560 N515 ppmos l=0.3u w=3u
C171 N577 0 25f
C172 Vout10 0 1f
V265 N497 0 2
V266 N551 0 1.2
V267 N529 0 1.8
I86 N577 0 228.75µ
M345 VDD N543 N573 0 nnmos l=0.3u w=3u
M346 N552 N573 0 0 nnmos l=0.3u w=3u
M347 Vout11 N486 N552 0 nnmos l=0.3u w=3u
M348 N493 N524 N552 N509 ppmos l=0.3u w=3u
C173 N573 0 25f
C174 Vout11 0 1f
V268 N493 0 2
V269 N543 0 1.2
V270 N524 0 1.8
I87 N573 0 232.25µ
M349 VDD N536 N569 0 nnmos l=0.3u w=3u
M350 N544 N569 0 0 nnmos l=0.3u w=3u
M351 Vout12 N486 N544 0 nnmos l=0.3u w=3u
M352 N489 N516 N544 N505 ppmos l=0.3u w=3u
C175 N569 0 25f
C176 Vout12 0 1f
V271 N489 0 2
V272 N536 0 1.2
V273 N516 0 1.8
I88 N569 0 276µ
M353 VDD N656 N678 0 nnmos l=0.3u w=3u
M354 N662 N678 0 0 nnmos l=0.3u w=3u
M355 Vout9 N583 N662 0 nnmos l=0.3u w=3u
M356 N598 N632 N662 N620 ppmos l=0.3u w=3u
C177 N678 0 25f
C178 Vout9 0 1f
V274 N598 0 2
V275 N656 0 1.2
V276 N632 0 1.8
I89 N678 0 232.25µ
M357 VDD N648 N674 0 nnmos l=0.3u w=3u
M358 N657 N674 0 0 nnmos l=0.3u w=3u
M359 Vout10 N583 N657 0 nnmos l=0.3u w=3u
M360 N594 N626 N657 N612 ppmos l=0.3u w=3u
C179 N674 0 25f
C180 Vout10 0 1f
V277 N594 0 2
V278 N648 0 1.2
V279 N626 0 1.8
I90 N674 0 230.5µ
M361 VDD N640 N670 0 nnmos l=0.3u w=3u
M362 N649 N670 0 0 nnmos l=0.3u w=3u
M363 Vout11 N583 N649 0 nnmos l=0.3u w=3u
M364 N590 N621 N649 N606 ppmos l=0.3u w=3u
C181 N670 0 25f
C182 Vout11 0 1f
V280 N590 0 2
V281 N640 0 1.2
V282 N621 0 1.8
I91 N670 0 272.5µ
M365 VDD N633 N666 0 nnmos l=0.3u w=3u
M366 N641 N666 0 0 nnmos l=0.3u w=3u
M367 Vout12 N583 N641 0 nnmos l=0.3u w=3u
M368 N586 N613 N641 N602 ppmos l=0.3u w=3u
C183 N666 0 25f
C184 Vout12 0 1f
V283 N586 0 2
V284 N633 0 1.2
V285 N613 0 1.8
I92 N666 0 377.5µ
M369 VDD N753 N775 0 nnmos l=0.3u w=3u
M370 N759 N775 0 0 nnmos l=0.3u w=3u
M371 Vout9 N680 N759 0 nnmos l=0.3u w=3u
M372 N695 N729 N759 N717 ppmos l=0.3u w=3u
C185 N775 0 25f
C186 Vout9 0 1f
V286 N695 0 2
V287 N753 0 1.2
V288 N729 0 1.8
I93 N775 0 232.25µ
M373 VDD N745 N771 0 nnmos l=0.3u w=3u
M374 N754 N771 0 0 nnmos l=0.3u w=3u
M375 Vout10 N680 N754 0 nnmos l=0.3u w=3u
M376 N691 N723 N754 N709 ppmos l=0.3u w=3u
C187 N771 0 25f
C188 Vout10 0 1f
V289 N691 0 2
V290 N745 0 1.2
V291 N723 0 1.8
I94 N771 0 274.25µ
M377 VDD N737 N767 0 nnmos l=0.3u w=3u
M378 N746 N767 0 0 nnmos l=0.3u w=3u
M379 Vout11 N680 N746 0 nnmos l=0.3u w=3u
M380 N687 N718 N746 N703 ppmos l=0.3u w=3u
C189 N767 0 25f
C190 Vout11 0 1f
V292 N687 0 2
V293 N737 0 1.2
V294 N718 0 1.8
I95 N767 0 377.5µ
M381 VDD N730 N763 0 nnmos l=0.3u w=3u
M382 N738 N763 0 0 nnmos l=0.3u w=3u
M383 Vout12 N680 N738 0 nnmos l=0.3u w=3u
M384 N683 N710 N738 N699 ppmos l=0.3u w=3u
C191 N763 0 25f
C192 Vout12 0 1f
V295 N683 0 2
V296 N730 0 1.2
V297 N710 0 1.8
I96 N763 0 379.25µ
M385 VDD N076 N097 0 nnmos l=0.3u w=3u
M386 N081 N097 0 0 nnmos l=0.3u w=3u
M387 Vout13 N001 N081 0 nnmos l=0.3u w=3u
M388 N017 N052 N081 N040 ppmos l=0.3u w=3u
C193 N097 0 25f
C194 Vout13 0 1f
V298 N017 0 2
V299 N076 0 1.2
V300 N052 0 1.8
I97 N097 0 370.5µ
M389 VDD N068 N093 0 nnmos l=0.3u w=3u
M390 N077 N093 0 0 nnmos l=0.3u w=3u
M391 Vout14 N001 N077 0 nnmos l=0.3u w=3u
M392 N013 N045 N077 N032 ppmos l=0.3u w=3u
C195 N093 0 25f
C196 Vout14 0 1f
V301 N013 0 2
V302 N068 0 1.2
V303 N045 0 1.8
I98 N093 0 370.5µ
M393 VDD N060 N089 0 nnmos l=0.3u w=3u
M394 N069 N089 0 0 nnmos l=0.3u w=3u
M395 Vout15 N001 N069 0 nnmos l=0.3u w=3u
M396 N009 N041 N069 N025 ppmos l=0.3u w=3u
C197 N089 0 25f
C198 Vout15 0 1f
V304 N009 0 2
V305 N060 0 1.2
V306 N041 0 1.8
I99 N089 0 368.75µ
M397 VDD N053 N085 0 nnmos l=0.3u w=3u
M398 N061 N085 0 0 nnmos l=0.3u w=3u
M399 Vout16 N001 N061 0 nnmos l=0.3u w=3u
M400 N005 N033 N061 N021 ppmos l=0.3u w=3u
C199 N085 0 25f
C200 Vout16 0 1f
V307 N005 0 2
V308 N053 0 1.2
V309 N033 0 1.8
I100 N085 0 374µ
M401 VDD N173 N194 0 nnmos l=0.3u w=3u
M402 N178 N194 0 0 nnmos l=0.3u w=3u
M403 Vout13 N098 N178 0 nnmos l=0.3u w=3u
M404 N114 N149 N178 N137 ppmos l=0.3u w=3u
C201 N194 0 25f
C202 Vout13 0 1f
V310 N114 0 2
V311 N173 0 1.2
V312 N149 0 1.8
I101 N194 0 291.75µ
M405 VDD N165 N190 0 nnmos l=0.3u w=3u
M406 N174 N190 0 0 nnmos l=0.3u w=3u
M407 Vout14 N098 N174 0 nnmos l=0.3u w=3u
M408 N110 N142 N174 N129 ppmos l=0.3u w=3u
C203 N190 0 25f
C204 Vout14 0 1f
V313 N110 0 2
V314 N165 0 1.2
V315 N142 0 1.8
I102 N190 0 375.75µ
M409 VDD N157 N186 0 nnmos l=0.3u w=3u
M410 N166 N186 0 0 nnmos l=0.3u w=3u
M411 Vout15 N098 N166 0 nnmos l=0.3u w=3u
M412 N106 N138 N166 N122 ppmos l=0.3u w=3u
C205 N186 0 25f
C206 Vout15 0 1f
V316 N106 0 2
V317 N157 0 1.2
V318 N138 0 1.8
I103 N186 0 377.5µ
M413 VDD N150 N182 0 nnmos l=0.3u w=3u
M414 N158 N182 0 0 nnmos l=0.3u w=3u
M415 Vout16 N098 N158 0 nnmos l=0.3u w=3u
M416 N102 N130 N158 N118 ppmos l=0.3u w=3u
C207 N182 0 25f
C208 Vout16 0 1f
V319 N102 0 2
V320 N150 0 1.2
V321 N130 0 1.8
I104 N182 0 381µ
M417 VDD N270 N291 0 nnmos l=0.3u w=3u
M418 N275 N291 0 0 nnmos l=0.3u w=3u
M419 Vout13 N195 N275 0 nnmos l=0.3u w=3u
M420 N211 N246 N275 N234 ppmos l=0.3u w=3u
C209 N291 0 25f
C210 Vout13 0 1f
V322 N211 0 2
V323 N270 0 1.2
V324 N246 0 1.8
I105 N291 0 241µ
M421 VDD N262 N287 0 nnmos l=0.3u w=3u
M422 N271 N287 0 0 nnmos l=0.3u w=3u
M423 Vout14 N195 N271 0 nnmos l=0.3u w=3u
M424 N207 N239 N271 N226 ppmos l=0.3u w=3u
C211 N287 0 25f
C212 Vout14 0 1f
V325 N207 0 2
V326 N262 0 1.2
V327 N239 0 1.8
I106 N287 0 293.5µ
M425 VDD N254 N283 0 nnmos l=0.3u w=3u
M426 N263 N283 0 0 nnmos l=0.3u w=3u
M427 Vout15 N195 N263 0 nnmos l=0.3u w=3u
M428 N203 N235 N263 N219 ppmos l=0.3u w=3u
C213 N283 0 25f
C214 Vout15 0 1f
V328 N203 0 2
V329 N254 0 1.2
V330 N235 0 1.8
I107 N283 0 375.75µ
M429 VDD N247 N279 0 nnmos l=0.3u w=3u
M430 N255 N279 0 0 nnmos l=0.3u w=3u
M431 Vout16 N195 N255 0 nnmos l=0.3u w=3u
M432 N199 N227 N255 N215 ppmos l=0.3u w=3u
C215 N279 0 25f
C216 Vout16 0 1f
V331 N199 0 2
V332 N247 0 1.2
V333 N227 0 1.8
I108 N279 0 382.75µ
M433 VDD N367 N388 0 nnmos l=0.3u w=3u
M434 N372 N388 0 0 nnmos l=0.3u w=3u
M435 Vout13 N292 N372 0 nnmos l=0.3u w=3u
M436 N308 N343 N372 N331 ppmos l=0.3u w=3u
C217 N388 0 25f
C218 Vout13 0 1f
V334 N308 0 2
V335 N367 0 1.2
V336 N343 0 1.8
I109 N388 0 344.25µ
M437 VDD N359 N384 0 nnmos l=0.3u w=3u
M438 N368 N384 0 0 nnmos l=0.3u w=3u
M439 Vout14 N292 N368 0 nnmos l=0.3u w=3u
M440 N304 N336 N368 N323 ppmos l=0.3u w=3u
C219 N384 0 25f
C220 Vout14 0 1f
V337 N304 0 2
V338 N359 0 1.2
V339 N336 0 1.8
I110 N384 0 244.5µ
M441 VDD N351 N380 0 nnmos l=0.3u w=3u
M442 N360 N380 0 0 nnmos l=0.3u w=3u
M443 Vout15 N292 N360 0 nnmos l=0.3u w=3u
M444 N300 N332 N360 N316 ppmos l=0.3u w=3u
C221 N380 0 25f
C222 Vout15 0 1f
V340 N300 0 2
V341 N351 0 1.2
V342 N332 0 1.8
I111 N380 0 300.5µ
M445 VDD N344 N376 0 nnmos l=0.3u w=3u
M446 N352 N376 0 0 nnmos l=0.3u w=3u
M447 Vout16 N292 N352 0 nnmos l=0.3u w=3u
M448 N296 N324 N352 N312 ppmos l=0.3u w=3u
C223 N376 0 25f
C224 Vout16 0 1f
V343 N296 0 2
V344 N344 0 1.2
V345 N324 0 1.8
I112 N376 0 382.75µ
M449 VDD N464 N485 0 nnmos l=0.3u w=3u
M450 N469 N485 0 0 nnmos l=0.3u w=3u
M451 Vout13 N389 N469 0 nnmos l=0.3u w=3u
M452 N405 N440 N469 N428 ppmos l=0.3u w=3u
C225 N485 0 25f
C226 Vout13 0 1f
V346 N405 0 2
V347 N464 0 1.2
V348 N440 0 1.8
I113 N485 0 375.75µ
M453 VDD N456 N481 0 nnmos l=0.3u w=3u
M454 N465 N481 0 0 nnmos l=0.3u w=3u
M455 Vout14 N389 N465 0 nnmos l=0.3u w=3u
M456 N401 N433 N465 N420 ppmos l=0.3u w=3u
C227 N481 0 25f
C228 Vout14 0 1f
V349 N401 0 2
V350 N456 0 1.2
V351 N433 0 1.8
I114 N481 0 342.5µ
M457 VDD N448 N477 0 nnmos l=0.3u w=3u
M458 N457 N477 0 0 nnmos l=0.3u w=3u
M459 Vout15 N389 N457 0 nnmos l=0.3u w=3u
M460 N397 N429 N457 N413 ppmos l=0.3u w=3u
C229 N477 0 25f
C230 Vout15 0 1f
V352 N397 0 2
V353 N448 0 1.2
V354 N429 0 1.8
I115 N477 0 293.5µ
M461 VDD N441 N473 0 nnmos l=0.3u w=3u
M462 N449 N473 0 0 nnmos l=0.3u w=3u
M463 Vout16 N389 N449 0 nnmos l=0.3u w=3u
M464 N393 N421 N449 N409 ppmos l=0.3u w=3u
C231 N473 0 25f
C232 Vout16 0 1f
V355 N393 0 2
V356 N441 0 1.2
V357 N421 0 1.8
I116 N473 0 372.25µ
M465 VDD N561 N582 0 nnmos l=0.3u w=3u
M466 N566 N582 0 0 nnmos l=0.3u w=3u
M467 Vout13 N486 N566 0 nnmos l=0.3u w=3u
M468 N502 N537 N566 N525 ppmos l=0.3u w=3u
C233 N582 0 25f
C234 Vout13 0 1f
V358 N502 0 2
V359 N561 0 1.2
V360 N537 0 1.8
I117 N582 0 377.5µ
M469 VDD N553 N578 0 nnmos l=0.3u w=3u
M470 N562 N578 0 0 nnmos l=0.3u w=3u
M471 Vout14 N486 N562 0 nnmos l=0.3u w=3u
M472 N498 N530 N562 N517 ppmos l=0.3u w=3u
C235 N578 0 25f
C236 Vout14 0 1f
V361 N498 0 2
V362 N553 0 1.2
V363 N530 0 1.8
I118 N578 0 375.75µ
M473 VDD N545 N574 0 nnmos l=0.3u w=3u
M474 N554 N574 0 0 nnmos l=0.3u w=3u
M475 Vout15 N486 N554 0 nnmos l=0.3u w=3u
M476 N494 N526 N554 N510 ppmos l=0.3u w=3u
C237 N574 0 25f
C238 Vout15 0 1f
V364 N494 0 2
V365 N545 0 1.2
V366 N526 0 1.8
I119 N574 0 333.75µ
M477 VDD N538 N570 0 nnmos l=0.3u w=3u
M478 N546 N570 0 0 nnmos l=0.3u w=3u
M479 Vout16 N486 N546 0 nnmos l=0.3u w=3u
M480 N490 N518 N546 N506 ppmos l=0.3u w=3u
C239 N570 0 25f
C240 Vout16 0 1f
V367 N490 0 2
V368 N538 0 1.2
V369 N518 0 1.8
I120 N570 0 223.5µ
M481 VDD N658 N679 0 nnmos l=0.3u w=3u
M482 N663 N679 0 0 nnmos l=0.3u w=3u
M483 Vout13 N583 N663 0 nnmos l=0.3u w=3u
M484 N599 N634 N663 N622 ppmos l=0.3u w=3u
C241 N679 0 25f
C242 Vout13 0 1f
V370 N599 0 2
V371 N658 0 1.2
V372 N634 0 1.8
I121 N679 0 377.5µ
M485 VDD N650 N675 0 nnmos l=0.3u w=3u
M486 N659 N675 0 0 nnmos l=0.3u w=3u
M487 Vout14 N583 N659 0 nnmos l=0.3u w=3u
M488 N595 N627 N659 N614 ppmos l=0.3u w=3u
C243 N675 0 25f
C244 Vout14 0 1f
V373 N595 0 2
V374 N650 0 1.2
V375 N627 0 1.8
I122 N675 0 375.75µ
M489 VDD N642 N671 0 nnmos l=0.3u w=3u
M490 N651 N671 0 0 nnmos l=0.3u w=3u
M491 Vout15 N583 N651 0 nnmos l=0.3u w=3u
M492 N591 N623 N651 N607 ppmos l=0.3u w=3u
C245 N671 0 25f
C246 Vout15 0 1f
V376 N591 0 2
V377 N642 0 1.2
V378 N623 0 1.8
I123 N671 0 337.25µ
M493 VDD N635 N667 0 nnmos l=0.3u w=3u
M494 N643 N667 0 0 nnmos l=0.3u w=3u
M495 Vout16 N583 N643 0 nnmos l=0.3u w=3u
M496 N587 N615 N643 N603 ppmos l=0.3u w=3u
C247 N667 0 25f
C248 Vout16 0 1f
V379 N587 0 2
V380 N635 0 1.2
V381 N615 0 1.8
I124 N667 0 386.25µ
M497 VDD N755 N776 0 nnmos l=0.3u w=3u
M498 N760 N776 0 0 nnmos l=0.3u w=3u
M499 Vout13 N680 N760 0 nnmos l=0.3u w=3u
M500 N696 N731 N760 N719 ppmos l=0.3u w=3u
C249 N776 0 25f
C250 Vout13 0 1f
V382 N696 0 2
V383 N755 0 1.2
V384 N731 0 1.8
I125 N776 0 375.75µ
M501 VDD N747 N772 0 nnmos l=0.3u w=3u
M502 N756 N772 0 0 nnmos l=0.3u w=3u
M503 Vout14 N680 N756 0 nnmos l=0.3u w=3u
M504 N692 N724 N756 N711 ppmos l=0.3u w=3u
C251 N772 0 25f
C252 Vout14 0 1f
V385 N692 0 2
V386 N747 0 1.2
V387 N724 0 1.8
I126 N772 0 375.75µ
M505 VDD N739 N768 0 nnmos l=0.3u w=3u
M506 N748 N768 0 0 nnmos l=0.3u w=3u
M507 Vout15 N680 N748 0 nnmos l=0.3u w=3u
M508 N688 N720 N748 N704 ppmos l=0.3u w=3u
C253 N768 0 25f
C254 Vout15 0 1f
V388 N688 0 2
V389 N739 0 1.2
V390 N720 0 1.8
I127 N768 0 335.5µ
M509 VDD N732 N764 0 nnmos l=0.3u w=3u
M510 N740 N764 0 0 nnmos l=0.3u w=3u
M511 Vout16 N680 N740 0 nnmos l=0.3u w=3u
M512 N684 N712 N740 N700 ppmos l=0.3u w=3u
C255 N764 0 25f
C256 Vout16 0 1f
V391 N684 0 2
V392 N732 0 1.2
V393 N712 0 1.8
I128 N764 0 386.25µ
M513 VDD N846 N870 0 nnmos l=0.3u w=3u
M514 N854 N870 0 0 nnmos l=0.3u w=3u
M515 Vout1 N777 N854 0 nnmos l=0.3u w=3u
M516 N790 N822 N854 N810 ppmos l=0.3u w=3u
C257 N870 0 25f
C258 Vout1 0 1f
V394 N790 0 2
V395 N846 0 1.2
V396 N822 0 1.8
I129 N870 0 220µ
M517 VDD N838 N866 0 nnmos l=0.3u w=3u
M518 N847 N866 0 0 nnmos l=0.3u w=3u
M519 Vout2 N777 N847 0 nnmos l=0.3u w=3u
M520 N786 N818 N847 N802 ppmos l=0.3u w=3u
C259 N866 0 25f
C260 Vout2 0 1f
V397 N786 0 2
V398 N838 0 1.2
V399 N818 0 1.8
I130 N866 0 244.5µ
M521 VDD N830 N862 0 nnmos l=0.3u w=3u
M522 N839 N862 0 0 nnmos l=0.3u w=3u
M523 Vout3 N777 N839 0 nnmos l=0.3u w=3u
M524 N782 N811 N839 N798 ppmos l=0.3u w=3u
C261 N862 0 25f
C262 Vout3 0 1f
V400 N782 0 2
V401 N830 0 1.2
V402 N811 0 1.8
I131 N862 0 242.75µ
M525 VDD N823 N858 0 nnmos l=0.3u w=3u
M526 N831 N858 0 0 nnmos l=0.3u w=3u
M527 Vout4 N777 N831 0 nnmos l=0.3u w=3u
M528 N778 N803 N831 N794 ppmos l=0.3u w=3u
C263 N858 0 25f
C264 Vout4 0 1f
V403 N778 0 2
V404 N823 0 1.2
V405 N803 0 1.8
I132 N858 0 239.25µ
M529 VDD N943 N967 0 nnmos l=0.3u w=3u
M530 N951 N967 0 0 nnmos l=0.3u w=3u
M531 Vout1 N874 N951 0 nnmos l=0.3u w=3u
M532 N887 N919 N951 N907 ppmos l=0.3u w=3u
C265 N967 0 25f
C266 Vout1 0 1f
V406 N887 0 2
V407 N943 0 1.2
V408 N919 0 1.8
I133 N967 0 223.5µ
M533 VDD N935 N963 0 nnmos l=0.3u w=3u
M534 N944 N963 0 0 nnmos l=0.3u w=3u
M535 Vout2 N874 N944 0 nnmos l=0.3u w=3u
M536 N883 N915 N944 N899 ppmos l=0.3u w=3u
C267 N963 0 25f
C268 Vout2 0 1f
V409 N883 0 2
V410 N935 0 1.2
V411 N915 0 1.8
I134 N963 0 246.25µ
M537 VDD N927 N959 0 nnmos l=0.3u w=3u
M538 N936 N959 0 0 nnmos l=0.3u w=3u
M539 Vout3 N874 N936 0 nnmos l=0.3u w=3u
M540 N879 N908 N936 N895 ppmos l=0.3u w=3u
C269 N959 0 25f
C270 Vout3 0 1f
V412 N879 0 2
V413 N927 0 1.2
V414 N908 0 1.8
I135 N959 0 244.5µ
M541 VDD N920 N955 0 nnmos l=0.3u w=3u
M542 N928 N955 0 0 nnmos l=0.3u w=3u
M543 Vout4 N874 N928 0 nnmos l=0.3u w=3u
M544 N875 N900 N928 N891 ppmos l=0.3u w=3u
C271 N955 0 25f
C272 Vout4 0 1f
V415 N875 0 2
V416 N920 0 1.2
V417 N900 0 1.8
I136 N955 0 241µ
M545 VDD N1040 N1064 0 nnmos l=0.3u w=3u
M546 N1048 N1064 0 0 nnmos l=0.3u w=3u
M547 Vout1 N971 N1048 0 nnmos l=0.3u w=3u
M548 N984 N1016 N1048 N1004 ppmos l=0.3u w=3u
C273 N1064 0 25f
C274 Vout1 0 1f
V418 N984 0 2
V419 N1040 0 1.2
V420 N1016 0 1.8
I137 N1064 0 288.25µ
M549 VDD N1032 N1060 0 nnmos l=0.3u w=3u
M550 N1041 N1060 0 0 nnmos l=0.3u w=3u
M551 Vout2 N971 N1041 0 nnmos l=0.3u w=3u
M552 N980 N1012 N1041 N996 ppmos l=0.3u w=3u
C275 N1060 0 25f
C276 Vout2 0 1f
V421 N980 0 2
V422 N1032 0 1.2
V423 N1012 0 1.8
I138 N1060 0 269µ
M553 VDD N1024 N1056 0 nnmos l=0.3u w=3u
M554 N1033 N1056 0 0 nnmos l=0.3u w=3u
M555 Vout3 N971 N1033 0 nnmos l=0.3u w=3u
M556 N976 N1005 N1033 N992 ppmos l=0.3u w=3u
C277 N1056 0 25f
C278 Vout3 0 1f
V424 N976 0 2
V425 N1024 0 1.2
V426 N1005 0 1.8
I139 N1056 0 249.75µ
M557 VDD N1017 N1052 0 nnmos l=0.3u w=3u
M558 N1025 N1052 0 0 nnmos l=0.3u w=3u
M559 Vout4 N971 N1025 0 nnmos l=0.3u w=3u
M560 N972 N997 N1025 N988 ppmos l=0.3u w=3u
C279 N1052 0 25f
C280 Vout4 0 1f
V427 N972 0 2
V428 N1017 0 1.2
V429 N997 0 1.8
I140 N1052 0 248µ
M561 VDD N1137 N1161 0 nnmos l=0.3u w=3u
M562 N1145 N1161 0 0 nnmos l=0.3u w=3u
M563 Vout1 N1068 N1145 0 nnmos l=0.3u w=3u
M564 N1081 N1113 N1145 N1101 ppmos l=0.3u w=3u
C281 N1161 0 25f
C282 Vout1 0 1f
V430 N1081 0 2
V431 N1137 0 1.2
V432 N1113 0 1.8
I141 N1161 0 381µ
M565 VDD N1129 N1157 0 nnmos l=0.3u w=3u
M566 N1138 N1157 0 0 nnmos l=0.3u w=3u
M567 Vout2 N1068 N1138 0 nnmos l=0.3u w=3u
M568 N1077 N1109 N1138 N1093 ppmos l=0.3u w=3u
C283 N1157 0 25f
C284 Vout2 0 1f
V433 N1077 0 2
V434 N1129 0 1.2
V435 N1109 0 1.8
I142 N1157 0 307.5µ
M569 VDD N1121 N1153 0 nnmos l=0.3u w=3u
M570 N1130 N1153 0 0 nnmos l=0.3u w=3u
M571 Vout3 N1068 N1130 0 nnmos l=0.3u w=3u
M572 N1073 N1102 N1130 N1089 ppmos l=0.3u w=3u
C285 N1153 0 25f
C286 Vout3 0 1f
V436 N1073 0 2
V437 N1121 0 1.2
V438 N1102 0 1.8
I143 N1153 0 253.25µ
M573 VDD N1114 N1149 0 nnmos l=0.3u w=3u
M574 N1122 N1149 0 0 nnmos l=0.3u w=3u
M575 Vout4 N1068 N1122 0 nnmos l=0.3u w=3u
M576 N1069 N1094 N1122 N1085 ppmos l=0.3u w=3u
C287 N1149 0 25f
C288 Vout4 0 1f
V439 N1069 0 2
V440 N1114 0 1.2
V441 N1094 0 1.8
I144 N1149 0 249.75µ
V442 N777 0 PULSE(0 2 8 1m 1m 1 16)
V443 N874 0 PULSE(0 2 9 1m 1m 1 16)
V444 N971 0 PULSE(0 2 10 1m 1m 1 16)
V445 N1068 0 PULSE(0 2 11 1m 1m 1 16)
M577 VDD N1234 N1258 0 nnmos l=0.3u w=3u
M578 N1242 N1258 0 0 nnmos l=0.3u w=3u
M579 Vout1 N1165 N1242 0 nnmos l=0.3u w=3u
M580 N1178 N1210 N1242 N1198 ppmos l=0.3u w=3u
C289 N1258 0 25f
C290 Vout1 0 1f
V446 N1178 0 2
V447 N1234 0 1.2
V448 N1210 0 1.8
I145 N1258 0 379.25µ
M581 VDD N1226 N1254 0 nnmos l=0.3u w=3u
M582 N1235 N1254 0 0 nnmos l=0.3u w=3u
M583 Vout2 N1165 N1235 0 nnmos l=0.3u w=3u
M584 N1174 N1206 N1235 N1190 ppmos l=0.3u w=3u
C291 N1254 0 25f
C292 Vout2 0 1f
V449 N1174 0 2
V450 N1226 0 1.2
V451 N1206 0 1.8
I146 N1254 0 330.25µ
M585 VDD N1218 N1250 0 nnmos l=0.3u w=3u
M586 N1227 N1250 0 0 nnmos l=0.3u w=3u
M587 Vout3 N1165 N1227 0 nnmos l=0.3u w=3u
M588 N1170 N1199 N1227 N1186 ppmos l=0.3u w=3u
C293 N1250 0 25f
C294 Vout3 0 1f
V452 N1170 0 2
V453 N1218 0 1.2
V454 N1199 0 1.8
I147 N1250 0 279.5µ
M589 VDD N1211 N1246 0 nnmos l=0.3u w=3u
M590 N1219 N1246 0 0 nnmos l=0.3u w=3u
M591 Vout4 N1165 N1219 0 nnmos l=0.3u w=3u
M592 N1166 N1191 N1219 N1182 ppmos l=0.3u w=3u
C295 N1246 0 25f
C296 Vout4 0 1f
V455 N1166 0 2
V456 N1211 0 1.2
V457 N1191 0 1.8
I148 N1246 0 251.5µ
M593 VDD N1331 N1355 0 nnmos l=0.3u w=3u
M594 N1339 N1355 0 0 nnmos l=0.3u w=3u
M595 Vout1 N1262 N1339 0 nnmos l=0.3u w=3u
M596 N1275 N1307 N1339 N1295 ppmos l=0.3u w=3u
C297 N1355 0 25f
C298 Vout1 0 1f
V458 N1275 0 2
V459 N1331 0 1.2
V460 N1307 0 1.8
I149 N1355 0 381µ
M597 VDD N1323 N1351 0 nnmos l=0.3u w=3u
M598 N1332 N1351 0 0 nnmos l=0.3u w=3u
M599 Vout2 N1262 N1332 0 nnmos l=0.3u w=3u
M600 N1271 N1303 N1332 N1287 ppmos l=0.3u w=3u
C299 N1351 0 25f
C300 Vout2 0 1f
V461 N1271 0 2
V462 N1323 0 1.2
V463 N1303 0 1.8
I150 N1351 0 372.25µ
M601 VDD N1315 N1347 0 nnmos l=0.3u w=3u
M602 N1324 N1347 0 0 nnmos l=0.3u w=3u
M603 Vout3 N1262 N1324 0 nnmos l=0.3u w=3u
M604 N1267 N1296 N1324 N1283 ppmos l=0.3u w=3u
C301 N1347 0 25f
C302 Vout3 0 1f
V464 N1267 0 2
V465 N1315 0 1.2
V466 N1296 0 1.8
I151 N1347 0 332µ
M605 VDD N1308 N1343 0 nnmos l=0.3u w=3u
M606 N1316 N1343 0 0 nnmos l=0.3u w=3u
M607 Vout4 N1262 N1316 0 nnmos l=0.3u w=3u
M608 N1263 N1288 N1316 N1279 ppmos l=0.3u w=3u
C303 N1343 0 25f
C304 Vout4 0 1f
V467 N1263 0 2
V468 N1308 0 1.2
V469 N1288 0 1.8
I152 N1343 0 270.75µ
M609 VDD N1428 N1452 0 nnmos l=0.3u w=3u
M610 N1436 N1452 0 0 nnmos l=0.3u w=3u
M611 Vout1 N1359 N1436 0 nnmos l=0.3u w=3u
M612 N1372 N1404 N1436 N1392 ppmos l=0.3u w=3u
C305 N1452 0 25f
C306 Vout1 0 1f
V470 N1372 0 2
V471 N1428 0 1.2
V472 N1404 0 1.8
I153 N1452 0 381µ
M613 VDD N1420 N1448 0 nnmos l=0.3u w=3u
M614 N1429 N1448 0 0 nnmos l=0.3u w=3u
M615 Vout2 N1359 N1429 0 nnmos l=0.3u w=3u
M616 N1368 N1400 N1429 N1384 ppmos l=0.3u w=3u
C307 N1448 0 25f
C308 Vout2 0 1f
V473 N1368 0 2
V474 N1420 0 1.2
V475 N1400 0 1.8
I154 N1448 0 374µ
M617 VDD N1412 N1444 0 nnmos l=0.3u w=3u
M618 N1421 N1444 0 0 nnmos l=0.3u w=3u
M619 Vout3 N1359 N1421 0 nnmos l=0.3u w=3u
M620 N1364 N1393 N1421 N1380 ppmos l=0.3u w=3u
C309 N1444 0 25f
C310 Vout3 0 1f
V476 N1364 0 2
V477 N1412 0 1.2
V478 N1393 0 1.8
I155 N1444 0 375.75µ
M621 VDD N1405 N1440 0 nnmos l=0.3u w=3u
M622 N1413 N1440 0 0 nnmos l=0.3u w=3u
M623 Vout4 N1359 N1413 0 nnmos l=0.3u w=3u
M624 N1360 N1385 N1413 N1376 ppmos l=0.3u w=3u
C311 N1440 0 25f
C312 Vout4 0 1f
V479 N1360 0 2
V480 N1405 0 1.2
V481 N1385 0 1.8
I156 N1440 0 340.75µ
M625 VDD N1525 N1549 0 nnmos l=0.3u w=3u
M626 N1533 N1549 0 0 nnmos l=0.3u w=3u
M627 Vout1 N1456 N1533 0 nnmos l=0.3u w=3u
M628 N1469 N1501 N1533 N1489 ppmos l=0.3u w=3u
C313 N1549 0 25f
C314 Vout1 0 1f
V482 N1469 0 2
V483 N1525 0 1.2
V484 N1501 0 1.8
I157 N1549 0 354.75µ
M629 VDD N1517 N1545 0 nnmos l=0.3u w=3u
M630 N1526 N1545 0 0 nnmos l=0.3u w=3u
M631 Vout2 N1456 N1526 0 nnmos l=0.3u w=3u
M632 N1465 N1497 N1526 N1481 ppmos l=0.3u w=3u
C315 N1545 0 25f
C316 Vout2 0 1f
V485 N1465 0 2
V486 N1517 0 1.2
V487 N1497 0 1.8
I158 N1545 0 349.5µ
M633 VDD N1509 N1541 0 nnmos l=0.3u w=3u
M634 N1518 N1541 0 0 nnmos l=0.3u w=3u
M635 Vout3 N1456 N1518 0 nnmos l=0.3u w=3u
M636 N1461 N1490 N1518 N1477 ppmos l=0.3u w=3u
C317 N1541 0 25f
C318 Vout3 0 1f
V488 N1461 0 2
V489 N1509 0 1.2
V490 N1490 0 1.8
I159 N1541 0 349.5µ
M637 VDD N1502 N1537 0 nnmos l=0.3u w=3u
M638 N1510 N1537 0 0 nnmos l=0.3u w=3u
M639 Vout4 N1456 N1510 0 nnmos l=0.3u w=3u
M640 N1457 N1482 N1510 N1473 ppmos l=0.3u w=3u
C319 N1537 0 25f
C320 Vout4 0 1f
V491 N1457 0 2
V492 N1502 0 1.2
V493 N1482 0 1.8
I160 N1537 0 349.5µ
V494 N1165 0 PULSE(0 2 12 1m 1m 1 16)
V495 N1262 0 PULSE(0 2 13 1m 1m 1 16)
V496 N1359 0 PULSE(0 2 14 1m 1m 1 16)
V497 N1456 0 PULSE(0 2 15 1m 1m 1 16)
M641 VDD N848 N871 0 nnmos l=0.3u w=3u
M642 N855 N871 0 0 nnmos l=0.3u w=3u
M643 Vout5 N777 N855 0 nnmos l=0.3u w=3u
M644 N791 N824 N855 N812 ppmos l=0.3u w=3u
C321 N871 0 25f
C322 Vout5 0 1f
V498 N791 0 2
V499 N848 0 1.2
V500 N824 0 1.8
I161 N871 0 232.25µ
M645 VDD N840 N867 0 nnmos l=0.3u w=3u
M646 N849 N867 0 0 nnmos l=0.3u w=3u
M647 Vout6 N777 N849 0 nnmos l=0.3u w=3u
M648 N787 N819 N849 N804 ppmos l=0.3u w=3u
C323 N867 0 25f
C324 Vout6 0 1f
V501 N787 0 2
V502 N840 0 1.2
V503 N819 0 1.8
I162 N867 0 269µ
M649 VDD N832 N863 0 nnmos l=0.3u w=3u
M650 N841 N863 0 0 nnmos l=0.3u w=3u
M651 Vout7 N777 N841 0 nnmos l=0.3u w=3u
M652 N783 N813 N841 N799 ppmos l=0.3u w=3u
C325 N863 0 25f
C326 Vout7 0 1f
V504 N783 0 2
V505 N832 0 1.2
V506 N813 0 1.8
I163 N863 0 276µ
M653 VDD N825 N859 0 nnmos l=0.3u w=3u
M654 N833 N859 0 0 nnmos l=0.3u w=3u
M655 Vout8 N777 N833 0 nnmos l=0.3u w=3u
M656 N779 N805 N833 N795 ppmos l=0.3u w=3u
C327 N859 0 25f
C328 Vout8 0 1f
V507 N779 0 2
V508 N825 0 1.2
V509 N805 0 1.8
I164 N859 0 277.75µ
M657 VDD N945 N968 0 nnmos l=0.3u w=3u
M658 N952 N968 0 0 nnmos l=0.3u w=3u
M659 Vout5 N874 N952 0 nnmos l=0.3u w=3u
M660 N888 N921 N952 N909 ppmos l=0.3u w=3u
C329 N968 0 25f
C330 Vout5 0 1f
V510 N888 0 2
V511 N945 0 1.2
V512 N921 0 1.8
I165 N968 0 283µ
M661 VDD N937 N964 0 nnmos l=0.3u w=3u
M662 N946 N964 0 0 nnmos l=0.3u w=3u
M663 Vout6 N874 N946 0 nnmos l=0.3u w=3u
M664 N884 N916 N946 N901 ppmos l=0.3u w=3u
C331 N964 0 25f
C332 Vout6 0 1f
V513 N884 0 2
V514 N937 0 1.2
V515 N916 0 1.8
I166 N964 0 354.75µ
M665 VDD N929 N960 0 nnmos l=0.3u w=3u
M666 N938 N960 0 0 nnmos l=0.3u w=3u
M667 Vout7 N874 N938 0 nnmos l=0.3u w=3u
M668 N880 N910 N938 N896 ppmos l=0.3u w=3u
C333 N960 0 25f
C334 Vout7 0 1f
V516 N880 0 2
V517 N929 0 1.2
V518 N910 0 1.8
I167 N960 0 377.5µ
M669 VDD N922 N956 0 nnmos l=0.3u w=3u
M670 N930 N956 0 0 nnmos l=0.3u w=3u
M671 Vout8 N874 N930 0 nnmos l=0.3u w=3u
M672 N876 N902 N930 N892 ppmos l=0.3u w=3u
C335 N956 0 25f
C336 Vout8 0 1f
V519 N876 0 2
V520 N922 0 1.2
V521 N902 0 1.8
I168 N956 0 377.5µ
M673 VDD N1042 N1065 0 nnmos l=0.3u w=3u
M674 N1049 N1065 0 0 nnmos l=0.3u w=3u
M675 Vout5 N971 N1049 0 nnmos l=0.3u w=3u
M676 N985 N1018 N1049 N1006 ppmos l=0.3u w=3u
C337 N1065 0 25f
C338 Vout5 0 1f
V522 N985 0 2
V523 N1042 0 1.2
V524 N1018 0 1.8
I169 N1065 0 346µ
M677 VDD N1034 N1061 0 nnmos l=0.3u w=3u
M678 N1043 N1061 0 0 nnmos l=0.3u w=3u
M679 Vout6 N971 N1043 0 nnmos l=0.3u w=3u
M680 N981 N1013 N1043 N998 ppmos l=0.3u w=3u
C339 N1061 0 25f
C340 Vout6 0 1f
V525 N981 0 2
V526 N1034 0 1.2
V527 N1013 0 1.8
I170 N1061 0 377.5µ
M681 VDD N1026 N1057 0 nnmos l=0.3u w=3u
M682 N1035 N1057 0 0 nnmos l=0.3u w=3u
M683 Vout7 N971 N1035 0 nnmos l=0.3u w=3u
M684 N977 N1007 N1035 N993 ppmos l=0.3u w=3u
C341 N1057 0 25f
C342 Vout7 0 1f
V528 N977 0 2
V529 N1026 0 1.2
V530 N1007 0 1.8
I171 N1057 0 377.5µ
M685 VDD N1019 N1053 0 nnmos l=0.3u w=3u
M686 N1027 N1053 0 0 nnmos l=0.3u w=3u
M687 Vout8 N971 N1027 0 nnmos l=0.3u w=3u
M688 N973 N999 N1027 N989 ppmos l=0.3u w=3u
C343 N1053 0 25f
C344 Vout8 0 1f
V531 N973 0 2
V532 N1019 0 1.2
V533 N999 0 1.8
I172 N1053 0 375.75µ
M689 VDD N1139 N1162 0 nnmos l=0.3u w=3u
M690 N1146 N1162 0 0 nnmos l=0.3u w=3u
M691 Vout5 N1068 N1146 0 nnmos l=0.3u w=3u
M692 N1082 N1115 N1146 N1103 ppmos l=0.3u w=3u
C345 N1162 0 25f
C346 Vout5 0 1f
V534 N1082 0 2
V535 N1139 0 1.2
V536 N1115 0 1.8
I173 N1162 0 346µ
M693 VDD N1131 N1158 0 nnmos l=0.3u w=3u
M694 N1140 N1158 0 0 nnmos l=0.3u w=3u
M695 Vout6 N1068 N1140 0 nnmos l=0.3u w=3u
M696 N1078 N1110 N1140 N1095 ppmos l=0.3u w=3u
C347 N1158 0 25f
C348 Vout6 0 1f
V537 N1078 0 2
V538 N1131 0 1.2
V539 N1110 0 1.8
I174 N1158 0 374µ
M697 VDD N1123 N1154 0 nnmos l=0.3u w=3u
M698 N1132 N1154 0 0 nnmos l=0.3u w=3u
M699 Vout7 N1068 N1132 0 nnmos l=0.3u w=3u
M700 N1074 N1104 N1132 N1090 ppmos l=0.3u w=3u
C349 N1154 0 25f
C350 Vout7 0 1f
V540 N1074 0 2
V541 N1123 0 1.2
V542 N1104 0 1.8
I175 N1154 0 375.75µ
M701 VDD N1116 N1150 0 nnmos l=0.3u w=3u
M702 N1124 N1150 0 0 nnmos l=0.3u w=3u
M703 Vout8 N1068 N1124 0 nnmos l=0.3u w=3u
M704 N1070 N1096 N1124 N1086 ppmos l=0.3u w=3u
C351 N1150 0 25f
C352 Vout8 0 1f
V543 N1070 0 2
V544 N1116 0 1.2
V545 N1096 0 1.8
I176 N1150 0 370.5µ
M705 VDD N1236 N1259 0 nnmos l=0.3u w=3u
M706 N1243 N1259 0 0 nnmos l=0.3u w=3u
M707 Vout5 N1165 N1243 0 nnmos l=0.3u w=3u
M708 N1179 N1212 N1243 N1200 ppmos l=0.3u w=3u
C353 N1259 0 25f
C354 Vout5 0 1f
V546 N1179 0 2
V547 N1236 0 1.2
V548 N1212 0 1.8
I177 N1259 0 316.25µ
M709 VDD N1228 N1255 0 nnmos l=0.3u w=3u
M710 N1237 N1255 0 0 nnmos l=0.3u w=3u
M711 Vout6 N1165 N1237 0 nnmos l=0.3u w=3u
M712 N1175 N1207 N1237 N1192 ppmos l=0.3u w=3u
C355 N1255 0 25f
C356 Vout6 0 1f
V549 N1175 0 2
V550 N1228 0 1.2
V551 N1207 0 1.8
I178 N1255 0 360µ
M713 VDD N1220 N1251 0 nnmos l=0.3u w=3u
M714 N1229 N1251 0 0 nnmos l=0.3u w=3u
M715 Vout7 N1165 N1229 0 nnmos l=0.3u w=3u
M716 N1171 N1201 N1229 N1187 ppmos l=0.3u w=3u
C357 N1251 0 25f
C358 Vout7 0 1f
V552 N1171 0 2
V553 N1220 0 1.2
V554 N1201 0 1.8
I179 N1251 0 374µ
M717 VDD N1213 N1247 0 nnmos l=0.3u w=3u
M718 N1221 N1247 0 0 nnmos l=0.3u w=3u
M719 Vout8 N1165 N1221 0 nnmos l=0.3u w=3u
M720 N1167 N1193 N1221 N1183 ppmos l=0.3u w=3u
C359 N1247 0 25f
C360 Vout8 0 1f
V555 N1167 0 2
V556 N1213 0 1.2
V557 N1193 0 1.8
I180 N1247 0 370.5µ
M721 VDD N1333 N1356 0 nnmos l=0.3u w=3u
M722 N1340 N1356 0 0 nnmos l=0.3u w=3u
M723 Vout5 N1262 N1340 0 nnmos l=0.3u w=3u
M724 N1276 N1309 N1340 N1297 ppmos l=0.3u w=3u
C361 N1356 0 25f
C362 Vout5 0 1f
V558 N1276 0 2
V559 N1333 0 1.2
V560 N1309 0 1.8
I181 N1356 0 244.5µ
M725 VDD N1325 N1352 0 nnmos l=0.3u w=3u
M726 N1334 N1352 0 0 nnmos l=0.3u w=3u
M727 Vout6 N1262 N1334 0 nnmos l=0.3u w=3u
M728 N1272 N1304 N1334 N1289 ppmos l=0.3u w=3u
C363 N1352 0 25f
C364 Vout6 0 1f
V561 N1272 0 2
V562 N1325 0 1.2
V563 N1304 0 1.8
I182 N1352 0 312.75µ
M729 VDD N1317 N1348 0 nnmos l=0.3u w=3u
M730 N1326 N1348 0 0 nnmos l=0.3u w=3u
M731 Vout7 N1262 N1326 0 nnmos l=0.3u w=3u
M732 N1268 N1298 N1326 N1284 ppmos l=0.3u w=3u
C365 N1348 0 25f
C366 Vout7 0 1f
V564 N1268 0 2
V565 N1317 0 1.2
V566 N1298 0 1.8
I183 N1348 0 314.5µ
M733 VDD N1310 N1344 0 nnmos l=0.3u w=3u
M734 N1318 N1344 0 0 nnmos l=0.3u w=3u
M735 Vout8 N1262 N1318 0 nnmos l=0.3u w=3u
M736 N1264 N1290 N1318 N1280 ppmos l=0.3u w=3u
C367 N1344 0 25f
C368 Vout8 0 1f
V567 N1264 0 2
V568 N1310 0 1.2
V569 N1290 0 1.8
I184 N1344 0 365.25µ
M737 VDD N1430 N1453 0 nnmos l=0.3u w=3u
M738 N1437 N1453 0 0 nnmos l=0.3u w=3u
M739 Vout5 N1359 N1437 0 nnmos l=0.3u w=3u
M740 N1373 N1406 N1437 N1394 ppmos l=0.3u w=3u
C369 N1453 0 25f
C370 Vout5 0 1f
V570 N1373 0 2
V571 N1430 0 1.2
V572 N1406 0 1.8
I185 N1453 0 328.5µ
M741 VDD N1422 N1449 0 nnmos l=0.3u w=3u
M742 N1431 N1449 0 0 nnmos l=0.3u w=3u
M743 Vout6 N1359 N1431 0 nnmos l=0.3u w=3u
M744 N1369 N1401 N1431 N1386 ppmos l=0.3u w=3u
C371 N1449 0 25f
C372 Vout6 0 1f